# EasyEDA Pro project ProPrj_FOC Motor Driver _V02.epro, board V01
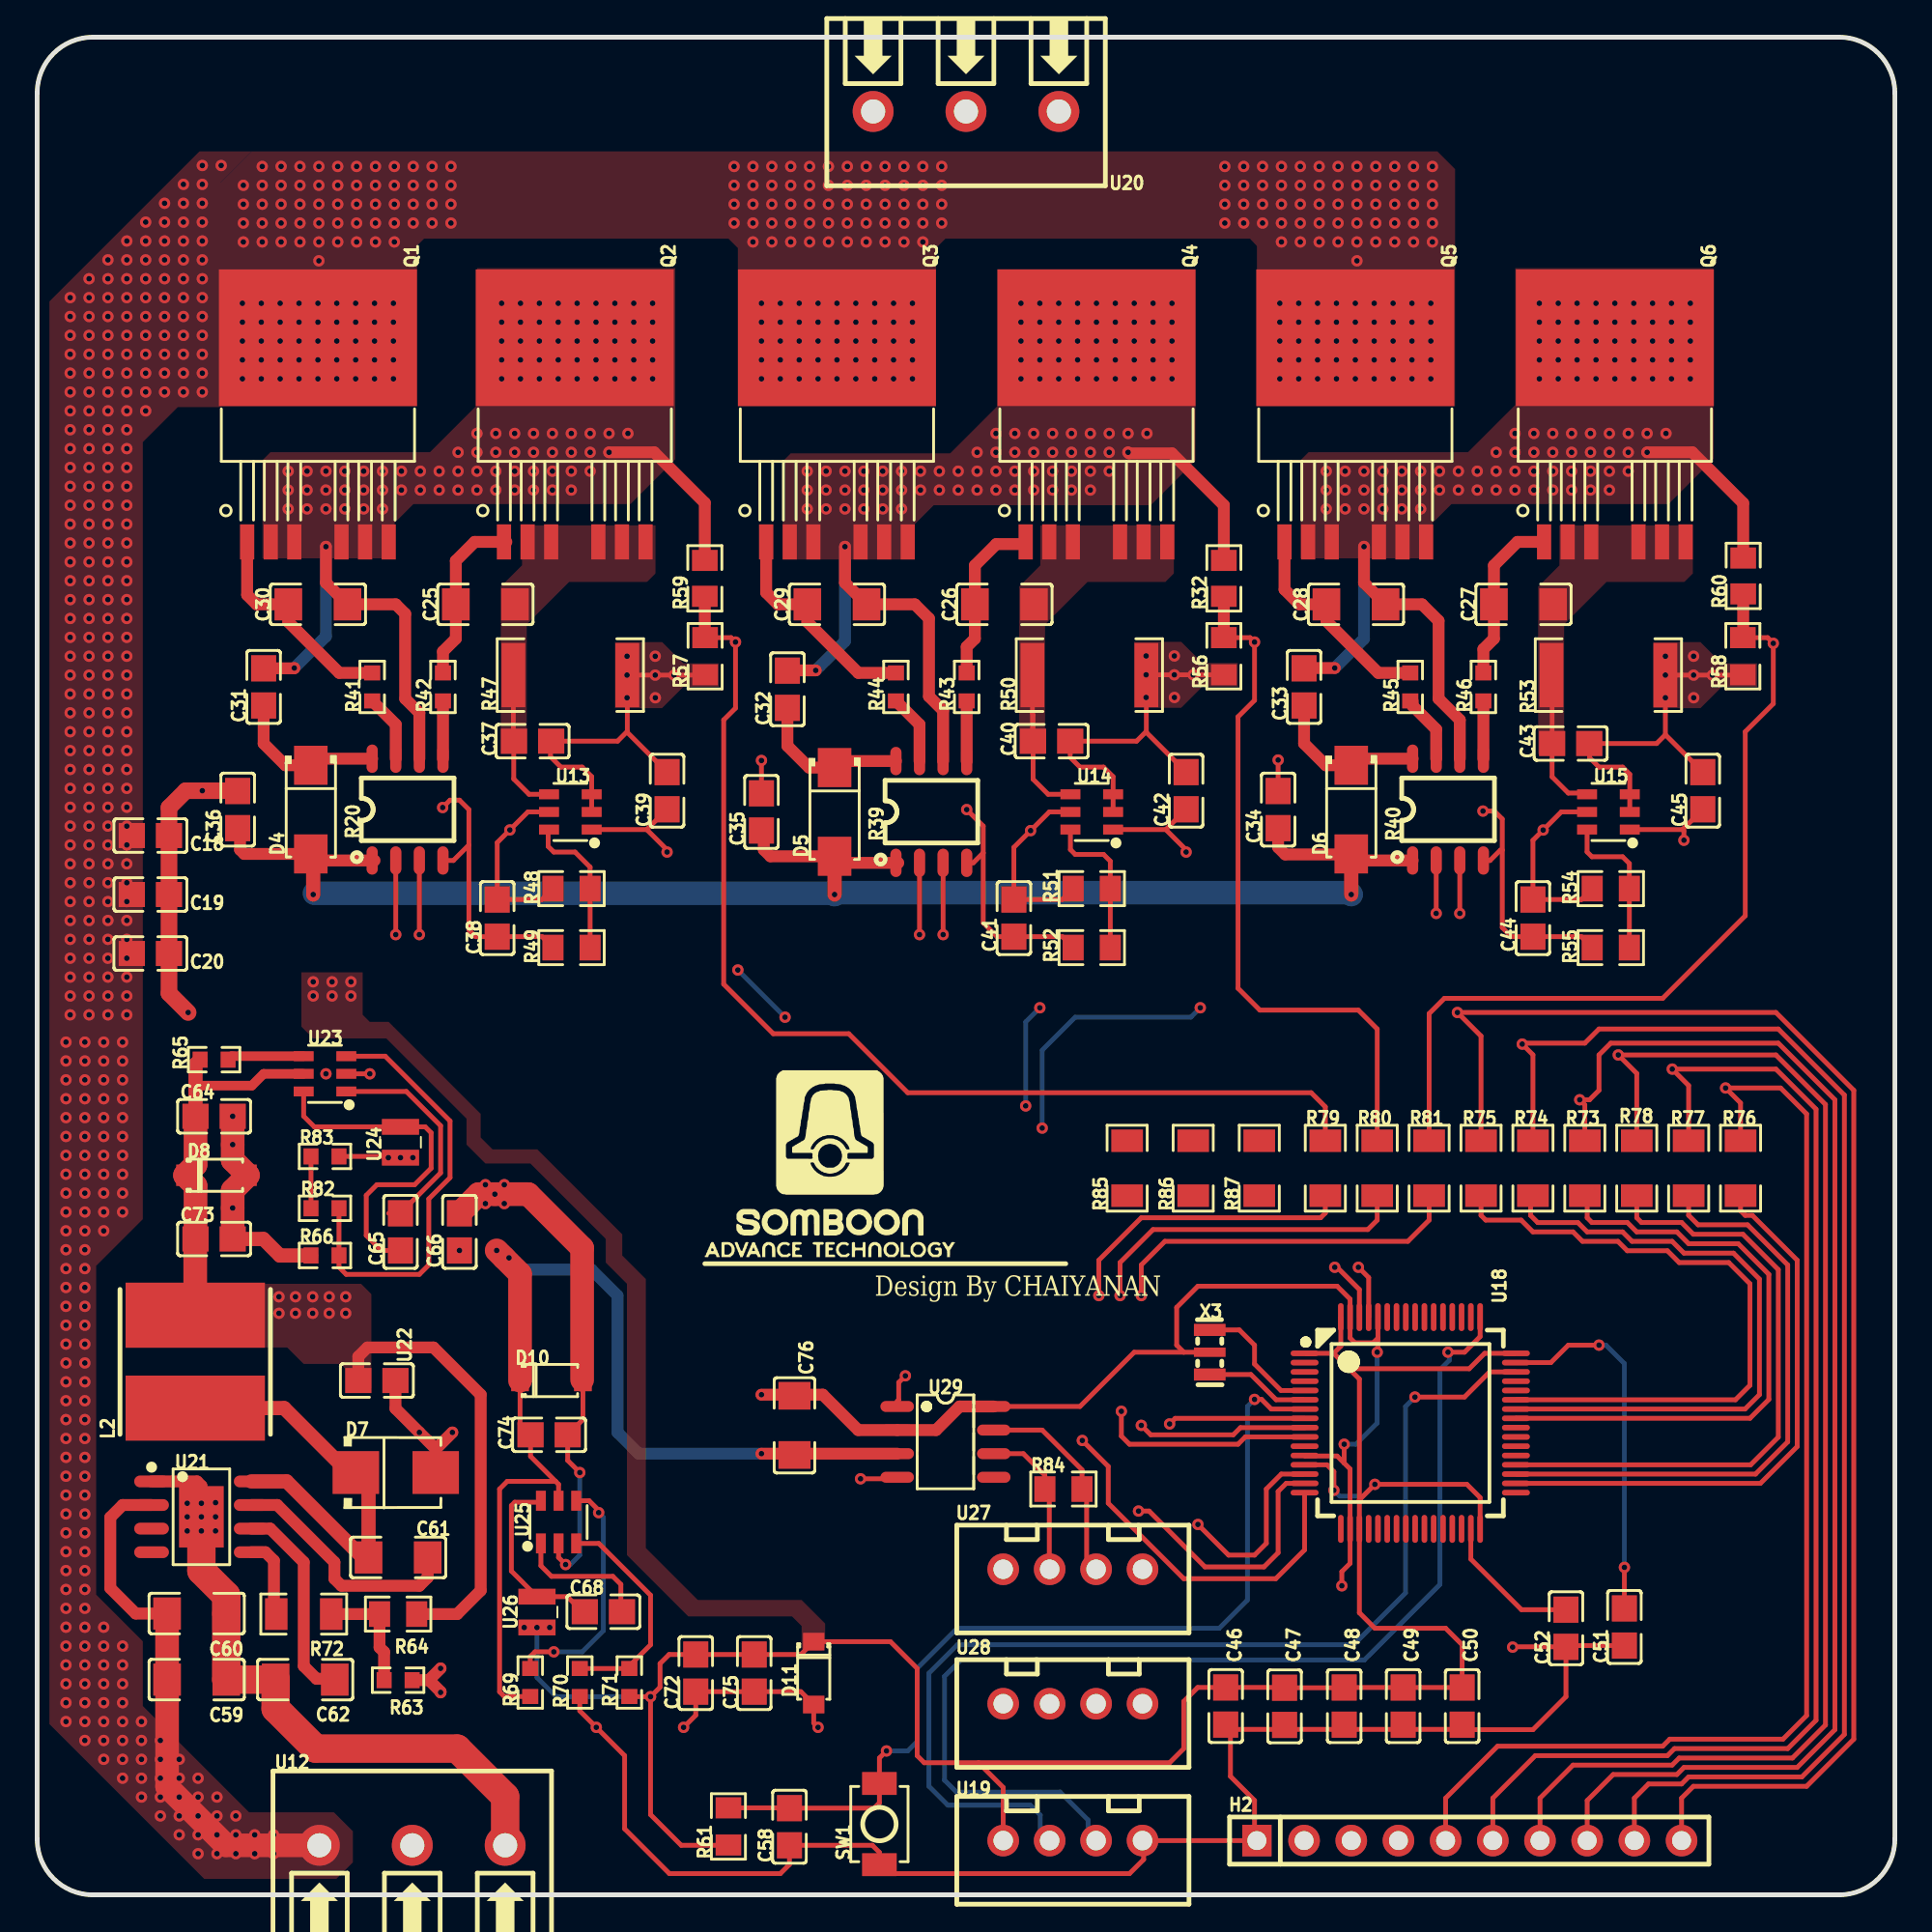
[diagram p12: board, top side]
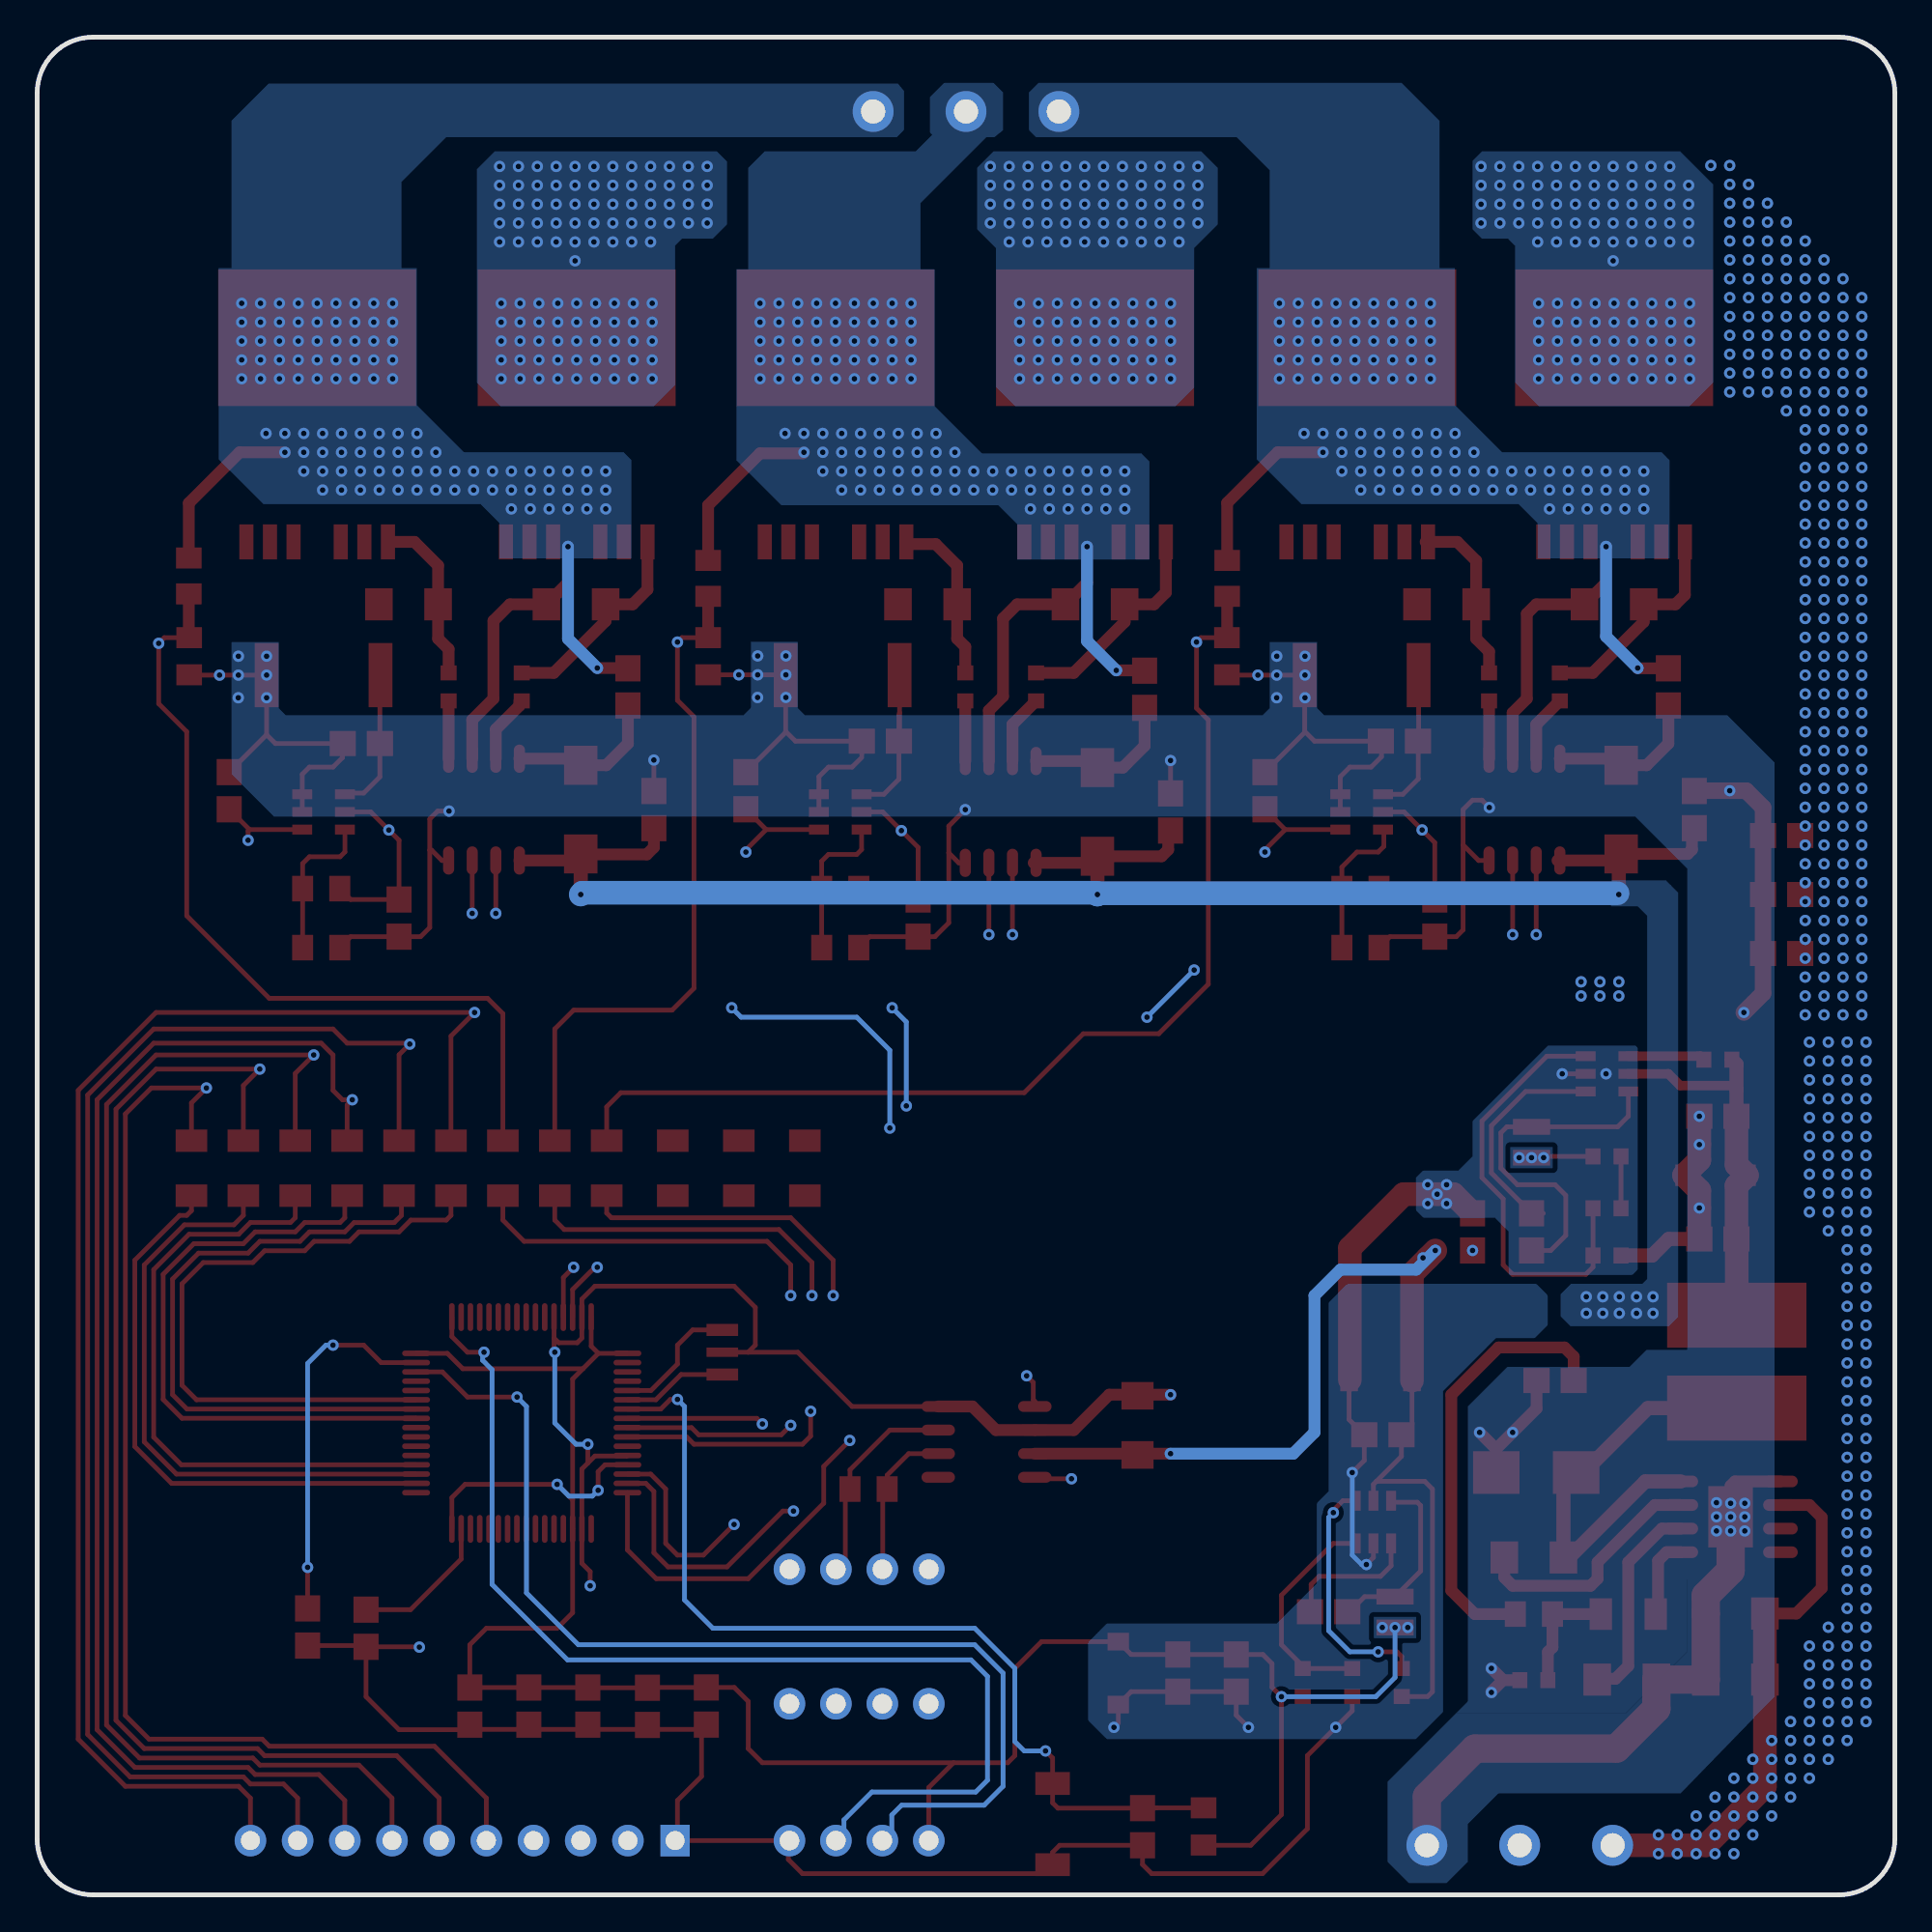
[diagram p13: board, bottom side, seen from below]

Outline 100 x 100 mm; copper layers: Top Layer, Inner1, Inner2, Bottom Layer. Coordinates in mm from the lower left corner of the outline.
Outline path: 0,97 0,3 arc(0.88,0.88) 3,0 97,0 arc(99.12,0.88) 100,3 100,97 arc(99.12,99.12) 97,100 3,100 arc(0.88,99.12) 0,97
Stack: Top Layer 0.035mm Outer layer thickness 1oz / Dielectric1 0.2104mm 7628 RC49% 8.6mil / Inner1 0.0152mm Inner layer thickness / Dielectric2 1.065mm 1.1mm H/HOZ Copper / Inner2 0.0152mm Inner layer thickness / Dielectric3 0.2104mm 7628 RC49% 8.6mil / Bottom Layer 0.035mm Outer layer thickness 1oz

## Design rules (mm)
template: JLCPCB Capability(Two Layers Board)
spacing copperThickness1oz (default): track to track 0.102, other pairs 0.152 to 0.3
spacing copperThickness2oz: track to track 0.203, other pairs 0.152 to 0.3
track width copperThickness1oz (default): min 0.127, default 0.254, max 2.54
track width copperThickness2oz: min 0.203, default 0.254, max 2.54
differential pair differentialPair (default): width min 0.127, default 0.254, max 2.54; gap min 0.152, default 0.152
via viaSize (default): diameter min 0.5, default 0.61, max 10; hole min 0.3, default 0.305, max 6.3

## Placement (name value [footprint] x y rotation side)
C18  2.2uF  [C0805]  6.1 57.02 180 top
C19  2.2uF  [C0805]  6.1 53.85 180 top
C20  2.2uF  [C0805]  6.1 50.67 180 top
C25  22nF  [C1206]  24.13 69.47 0 top
C26  22nF  [C1206]  52.07 69.47 0 top
C27  22nF  [C1206]  80.01 69.47 0 top
C28  22nF  [C1206]  70.99 69.47 0 top
C29  22nF  [C1206]  43.05 69.47 0 top
C30  22nF  [C1206]  15.11 69.47 0 top
C31  10uF  [C0805]  12.19 65.02 270 top
C32  10uF  [C0805]  40.39 64.9 270 top
C33  10uF  [C0805]  68.2 65.02 270 top
C34  10uF  [C0805]  66.8 58.42 270 top
C35  10uF  [C0805]  38.99 58.29 270 top
C36  10uF  [C0805]  10.8 58.42 270 top
C37  100nF  [C0805]  26.67 62.1 180 top
C38  100nF  [C0805]  24.77 52.58 90 top
C39  100nF  [C0805]  33.91 59.44 90 top
C40  100nF  [C0805]  54.61 62.1 180 top
C41  100nF  [C0805]  52.58 52.58 90 top
C42  100nF  [C0805]  61.85 59.44 90 top
C43  100nF  [C0805]  82.55 61.98 180 top
C44  100nF  [C0805]  80.52 52.58 90 top
C45  100nF  [C0805]  89.66 59.44 90 top
C46  1uF  [C0805]  63.98 10.16 90 top
C47  1uF  [C0805]  67.15 10.15 90 top
C48  1uF  [C0805]  70.36 10.16 90 top
C49  2.2uF  [C0805]  73.53 10.16 90 top
C50  1uF  [C0805]  76.71 10.16 90 top
C51  2.2uF  [C0805]  85.44 14.42 90 top
C52  2.2uF  [C0805]  82.3 14.35 90 top
C58  100nF  [C0805]  40.5 3.67 270 top
C59  100nF  [C1206]  8.59 11.59 180 top
C60  2.2uF  [C1206]  8.59 15.14 180 top
C61  100nF  [C1206]  19.43 18.16 180 top
C62  2.2uF  [C1206]  14.43 11.59 180 top
C64  4.7uF  [C0805]  9.53 41.91 180 top
C65  22nF  [C0805]  19.56 35.69 270 top
C66  4.7uF  [C0805]  22.73 35.69 270 top
C68  22nF  [C0805]  30.48 15.24 180 top
C72  1uF  [C0805]  35.45 11.94 90 top
C73  22uF  [C0805]  9.53 35.31 180 top
C74  22uF  [C0805]  27.56 24.76 180 top
C75  22uF  [C0805]  38.6 11.94 90 top
C76  2.2uF  [C1206]  40.77 25.27 270 top
D4  FR107  [SMA_L4.2-W2.7-LS5.3-FD]  14.73 58.42 90 top
D5  FR107  [SMA_L4.2-W2.7-LS5.3-FD]  42.93 58.29 90 top
D6  FR107  [SMA_L4.2-W2.7-LS5.3-FD]  70.74 58.42 90 top
D7  SS510B  [SMB_L4.3-W3.6-LS5.3-RD]  19.3 22.73 0 top
D8  SMF12A  [SOD-123_L2.8-W1.8-LS3.7-RD]  9.65 38.73 0 top
D10  SMF5.0A  [SOD-123_L2.8-W1.8-LS3.7-RD]  27.69 27.69 0 top
D11  SMF3.3A  [SOD-123_L2.8-W1.8-LS3.7-RD]  41.8 11.94 270 top
H2  XY-PZ2.54V-01-10P  [HDR-TH_10P-P2.54-V-M_4]  77.09 2.92 0 top
L2  68uH  [IND-SMD_L7.8-W7.0_SCD0705N]  8.51 28.7 90 top
Q1  IRFS7530TRL7PP  [D2PAK-7_L10.6-W9.6-P1.27-LS15.9-BR]  15.11 78.32 270 top
Q2  IRFS7530TRL7PP  [D2PAK-7_L10.6-W9.6-P1.27-LS15.9-BR]  28.94 78.32 270 top
Q3  IRFS7530TRL7PP  [D2PAK-7_L10.6-W9.6-P1.27-LS15.9-BR]  43.05 78.32 270 top
Q4  IRFS7530TRL7PP  [D2PAK-7_L10.6-W9.6-P1.27-LS15.9-BR]  57.02 78.32 270 top
Q5  IRFS7530TRL7PP  [D2PAK-7_L10.6-W9.6-P1.27-LS15.9-BR]  70.96 78.32 270 top
Q6  IRFS7530TRL7PP  [D2PAK-7_L10.6-W9.6-P1.27-LS15.9-BR]  84.93 78.32 270 top
R20  EG3112D  [SOP-8_L5.0-W3.9-P1.27-LS6.0-BL-1]  19.94 58.42 0 top
R32  56K  [R0805_NEW]  63.88 70.87 90 top
R39  EG3112D  [SOP-8_L5.0-W3.9-P1.27-LS6.0-BL-1]  48.13 58.29 0 top
R40  EG3112D  [SOP-8_L5.0-W3.9-P1.27-LS6.0-BL-1]  75.95 58.42 0 top
R41  10Ω  [R0603]  18.03 65.02 90 top
R42  10Ω  [R0603]  21.84 65.02 90 top
R43  10Ω  [R0603]  50.04 65.02 90 top
R44  10Ω  [R0603]  46.23 65.02 90 top
R45  10Ω  [R0603]  73.91 65.02 90 top
R46  10Ω  [R0603]  77.85 65.02 90 top
R47  1mΩ  [R2512]  28.7 65.66 180 top
R48  1kΩ  [R0805]  28.77 54.17 0 top
R49  1kΩ  [R0805]  28.77 50.99 0 top
R50  1mΩ  [R2512]  56.64 65.66 180 top
R51  1kΩ  [R0805]  56.77 54.17 0 top
R52  1kΩ  [R0805]  56.77 50.99 0 top
R53  1mΩ  [R2512]  84.58 65.66 180 top
R54  1kΩ  [R0805]  84.71 54.17 0 top
R55  1kΩ  [R0805]  84.71 50.99 0 top
R56  2.2kΩ  [R0805]  63.88 66.67 90 top
R57  2.2kΩ  [R0805]  35.96 66.67 90 top
R58  2.2kΩ  [R0805]  91.82 66.67 90 top
R59  56K  [R0805_NEW]  35.94 70.87 90 top
R60  56K  [R0805_NEW]  91.84 71 90 top
R61  10kΩ  [R0805]  37.21 3.68 90 top
R63  30kΩ  [R0603]  19.43 11.56 180 top
R64  274kΩ  [R0805]  19.43 15.11 0 top
R65  10kΩ  [R0603]  9.53 44.96 0 top
R66  10kΩ  [R0603]  15.49 34.42 0 top
R69  10kΩ  [R0603]  26.54 11.43 90 top
R70  10kΩ  [R0603]  29.21 11.43 90 top
R71  45.3kΩ  [R0603]  31.88 11.43 270 top
R72  5.1kΩ  [R1206]  14.35 15.11 0 top
R73  0Ω  [R1206]  83.31 39.12 270 top
R74  0Ω  [R1206]  80.52 39.12 270 top
R75  0Ω  [R1206]  77.72 39.12 270 top
R76  0Ω  [R1206]  91.69 39.12 270 top
R77  0Ω  [R1206]  88.9 39.12 270 top
R78  0Ω  [R1206]  86.11 39.12 270 top
R79  0Ω  [R1206]  69.34 39.12 270 top
R80  0Ω  [R1206]  72.14 39.12 270 top
R81  0Ω  [R1206]  74.93 39.12 270 top
R82  4.3kΩ  [R0603]  15.49 36.96 180 top
R83  73.2kΩ  [R0603]  15.49 39.75 0 top
R84  120Ω  [R0805]  55.25 21.84 0 top
R85  0Ω  [R1206]  58.67 39.12 90 top
R86  0Ω  [R1206]  62.23 39.12 90 top
R87  0Ω  [R1206]  65.79 39.12 90 top
SW1  TS-1088-AR02016  [SW-SMD_L3.9-W3.0-P4.45]  45.34 3.81 90 top
U12  1935174  [CONN-TH_3P-P5.00_1935174]  20.19 2.67 0 top
U13  INA181A1IDBVR  [SOT-23-6_L2.9-W1.6-P0.95-LS2.8-TL]  28.7 58.29 180 top
U14  INA181A1IDBVR  [SOT-23-6_L2.9-W1.6-P0.95-LS2.8-TL]  56.77 58.29 180 top
U15  INA181A1IDBVR  [SOT-23-6_L2.9-W1.6-P0.95-LS2.8-TL]  84.58 58.29 180 top
U18  STM32F405RGT6  [LQFP-64_L10.0-W10.0-P0.50-LS12.0-BL]  73.91 25.4 270 top
U19  xh2.54-4p(直针)  [CONN-TH_4P-P2.50-XH2.54-4P]  55.75 2.92 0 top
U20  1935174  [CONN-TH_3P-P5.00_1935174]  50 96 180 top
U21  SCT2A23STER  [ESOP-8_L4.9-W3.9-P1.27-LS6.0-BL-EP-1]  8.84 20.35 270 top
U22  68pF  [C0805]  18.29 27.69 180 top
U23  RY8120  [SOT-23-6_L2.9-W1.6-P0.95-LS2.8-BL]  15.49 44.2 90 top
U24  2.2uH  [IND-SMD_L2.5-W2.0-VLS252012CX-150M]  19.56 40.51 270 top
U25  RY8120  [SOT-23-6_L2.9-W1.6-P0.95-LS2.8-BL]  28.07 20.07 0 top
U26  2.2uH  [IND-SMD_L2.5-W2.0-VLS252012CX-150M]  26.91 15.22 270 top
U27  xh2.54-4p(直针)  [CONN-TH_4P-P2.50-XH2.54-4P]  55.75 17.53 0 top
U28  xh2.54-4p(直针)  [CONN-TH_4P-P2.50-XH2.54-4P]  55.75 10.29 0 top
U29  MCP2551-I/SN  [SOIC-8_L4.9-W3.9-P1.27-LS6.0-BL]  48.9 24.38 270 top
X3  8MHz  [OSC-SMD_3P-L3.2-W1.3-P1.2-L]  63.12 29.21 270 top

## Footprints (pads in the part's own frame, mm; a bottom-side part is the same pattern mirrored in y, then rotated)
C0805
  rect 1.41x1.35 smd: 1(-1,0) 2(1,0)
C1206
  rect 1.485x1.728 smd: 1(-1.593,0) 2(1.593,0)
CONN-TH_3P-P5.00_1935174
  round 2.2 hole 1.3: 1(-5,0) 2(0,0) 3(5,0)
CONN-TH_4P-P2.50-XH2.54-4P
  round 1.7 hole 1.05: 1(3.75,0) 2(1.25,0) 3(-1.25,0) 4(-3.75,0)
D2PAK-7_L10.6-W9.6-P1.27-LS15.9-BR
  rect 1.887x0.762 smd: 1(5.495,-3.81) 2(5.495,-2.54) 3(5.495,-1.27) 5(5.495,1.27) 6(5.495,2.54) 7(5.495,3.81)
  rect 7.356x10.66 smd: 4(-5.495,0)
ESOP-8_L4.9-W3.9-P1.27-LS6.0-BL-EP-1
  oval 0.63x1.865 smd: 1(-1.905,-2.683) 2(-0.635,-2.683) 3(0.635,-2.683) 4(1.905,-2.683) 5(1.905,2.683) 6(0.635,2.683) 7(-0.635,2.683) 8(-1.905,2.683)
  rect 3.3x2.4 smd: 9(0,0)
HDR-TH_10P-P2.54-V-M_4
  rect 1.575x1.7 hole 1.02: 1(-11.43,0)
  round 1.7 hole 1.02: 2(-8.89,0) 3(-6.35,0) 4(-3.81,0) 5(-1.27,0) 6(1.27,0) 7(3.81,0) 8(6.35,0) 9(8.89,0) 10(11.43,0)
IND-SMD_L2.5-W2.0-VLS252012CX-150M
  rect 0.85x2 smd: 1(-0.83,0) 2(0.83,0)
IND-SMD_L7.8-W7.0_SCD0705N
  rect 3.5x7.5 smd: 1(-2.5,0) 2(2.5,0)
LQFP-64_L10.0-W10.0-P0.50-LS12.0-BL
  oval 0.3x1.5 smd: 1(-3.75,-5.688) 2(-3.25,-5.688) 3(-2.75,-5.688) 4(-2.25,-5.688) 5(-1.75,-5.688) 6(-1.25,-5.688) 7(-0.75,-5.688) 8(-0.25,-5.688) 9(0.25,-5.688) 10(0.75,-5.688) 11(1.25,-5.688) 12(1.75,-5.688) 13(2.25,-5.688) 14(2.75,-5.688) 15(3.25,-5.688) 16(3.75,-5.688) 33(3.75,5.688) 34(3.25,5.688) 35(2.75,5.688) 36(2.25,5.688) 37(1.75,5.688) 38(1.25,5.688) 39(0.75,5.688) 40(0.25,5.688) 41(-0.25,5.688) 42(-0.75,5.688) 43(-1.25,5.688) 44(-1.75,5.688) 45(-2.25,5.688) 46(-2.75,5.688) 47(-3.25,5.688) 48(-3.75,5.688)
  oval 1.5x0.3 smd: 17(5.7,-3.738) 18(5.7,-3.238) 19(5.7,-2.738) 20(5.7,-2.238) 21(5.7,-1.738) 22(5.7,-1.238) 23(5.7,-0.739) 24(5.7,-0.238) 25(5.7,0.262) 26(5.7,0.762) 27(5.7,1.262) 28(5.7,1.762) 29(5.7,2.261) 30(5.7,2.762) 31(5.7,3.261) 32(5.7,3.762) 49(-5.7,3.762) 50(-5.7,3.261) 51(-5.7,2.762) 52(-5.7,2.261) 53(-5.7,1.762) 54(-5.7,1.262) 55(-5.7,0.762) 56(-5.7,0.262) 57(-5.7,-0.238) 58(-5.7,-0.739) 59(-5.7,-1.238) 60(-5.7,-1.738) 61(-5.7,-2.238) 62(-5.7,-2.738) 63(-5.7,-3.238) 64(-5.7,-3.738)
OSC-SMD_3P-L3.2-W1.3-P1.2-L
  rect 0.65x1.7 smd: 1(-1.2,0) 3(1.2,0)
  rect 0.5x1.7 smd: 2(0,0)
R0603
  rect 0.806x0.864 smd: 1(-0.753,0) 2(0.753,0)
R0805
  rect 1.133x1.377 smd: 1(-1,0) 2(1,0)
R0805_NEW
  rect 1.133x1.377 smd: 1(-0.966,0) 2(0.966,0)
R1206
  rect 1.208x1.701 smd: 1(-1.479,0) 2(1.479,0)
R2512
  rect 1.282x3.456 smd: 1(-3.067,0) 2(3.067,0)
SMA_L4.2-W2.7-LS5.3-FD
  rect 2.1x1.8 smd: 1(-2.386,0) 2(2.386,0)
SMB_L4.3-W3.6-LS5.3-RD
  rect 2.5x2.3 smd: 1(-2.15,0) 2(2.15,0)
SOD-123_L2.8-W1.8-LS3.7-RD
  rect 0.95x1.15 smd: 1(-1.692,0) 2(1.692,0)
SOIC-8_L4.9-W3.9-P1.27-LS6.0-BL
  oval 0.588x1.8 smd: 1(-1.905,-2.6) 2(-0.635,-2.6) 3(0.635,-2.6) 4(1.905,-2.6) 5(1.905,2.6) 6(0.635,2.6) 7(-0.635,2.6) 8(-1.905,2.6)
SOP-8_L5.0-W3.9-P1.27-LS6.0-BL-1
  oval 0.6x1.52 smd: 1(-1.905,-2.74) 2(-0.635,-2.74) 3(0.635,-2.74) 4(1.905,-2.74) 5(1.905,2.74) 6(0.635,2.74) 7(-0.635,2.74) 8(-1.905,2.74)
SOT-23-6_L2.9-W1.6-P0.95-LS2.8-BL
  rect 0.532x1.072 smd: 1(-0.95,-1.149) 2(0,-1.149) 3(0.95,-1.149) 4(0.95,1.149) 5(0,1.149) 6(-0.95,1.149)
SOT-23-6_L2.9-W1.6-P0.95-LS2.8-TL
  rect 1.072x0.532 smd: 1(-1.149,0.95) 2(-1.149,0) 3(-1.149,-0.95) 4(1.149,-0.95) 5(1.149,0) 6(1.149,0.95)
SW-SMD_L3.9-W3.0-P4.45
  rect 1.23x1.86 smd: 1(-2.185,0) 2(2.185,0)

## Nets
As in the schematic.

Pads without a net: R85 2; R86 2; R87 2; U12 2; U18 2 3 4 11 17 20 21 22 23 24 25 26 27 28 29 30 33 37 38 39 40 50 51 52 53 54 55 56 57 58 59; U21 3 4; U27 1 4; U28 1 2 3 4; U29 5

## Via types
v1: diameter 0.61, hole 0.305, Top Layer to Bottom Layer, 1114 vias

## Routing (per net, layer and track width the routed paths; a pad name or vN(x,y) marks a point on that pad's centre or on a via; arc(x,y) is an arc through that point)
3.3V: length 231.8
  Top Layer w0.254: 70.62,28.32 77.09,28.32 77.92,29.15 U18.48 ; 70.62,28.32 69.79,29.15 ; 70.62,28.32 71.18,27.76 71.18,21.26 ; 71.18,21.26 U18.19 71.18,15.18 72.01,14.35 75.82,14.35 76.71,13.46 C50.2 C49.2 C48.2 70.35,11.15 C47.2 67.13,11.16 C46.2 62.47,11.16 61.72,10.41 61.72,7.87 60.96,7.11 50.67,7.11 ; 71.18,21.26 v1(72.01,22.1) 76.96,22.1 77.68,21.38 U18.32 ; 50.67,7.11 52,5.78 U19.4 ; 50.67,7.11 47.75,7.11 47.37,7.49 47.37,12.19 45.93,13.63 D11.1 41.11,12.94 C75.2 C72.2 34.02,12.94 33.53,12.45 33.53,11.18 v1(33.02,10.67) ; R71.2 31.89,10.67 v1(33.02,10.67) ; 69.79,29.15 70.18,29.54 U18.64 ; 69.79,29.15 U18.1 ; v1(33.02,10.67) 33.02,4.32 34.67,2.67 37.19,2.67 R61.1 ; R48.1 27.18,53.58 C38.2 24.77,56.64 v1(25.45,57.32) 26.42,58.29 U13.5 ; v1(69.8,21.78) 69.8,22.78 69.43,23.15 U18.13 ; U15.5 82.04,58.29 v1(81.07,57.32) 80.52,56.77 C44.2 83.12,53.58 R54.1 ; R51.1 55.18,53.58 C41.2 52.58,56.39 v1(53.48,57.29) 54.48,58.29 U14.5
  Inner2 w0.508: v1(81.07,57.32) 81.04,57.29 v1(53.48,57.29) 53.44,57.32 v1(25.45,57.32)
  Inner2 w0.889: v1(25.45,57.32) 19.99,57.32 15.88,53.21 15.88,49.29
  Bottom Layer w0.254: v1(33.02,10.67) 27.94,10.67 26.91,11.7 v1(26.91,14.39) ; v1(69.8,21.78) 70.12,21.46 71.37,21.46 v1(72.01,22.1)
  vias: v1(14.86,49.15) v1(14.86,48.39) v1(15.88,49.15) v1(15.88,48.39) v1(16.89,49.15) v1(16.89,48.39) v1(26.22,14.39) v1(27.59,14.39)
12V: length 132.2
  Top Layer w0.508: 8.53,43.35 8.74,43.56 11.56,43.56 12.19,44.2 U23.5
  Top Layer w0.635: R64.2 22.61,15.11 23.88,16.38 23.88,26.92 21.34,29.46 17.78,29.46 17.29,28.97 U22.2 ; R40.1 71.09,55.68 D6.1 70.71,56.01 67.18,56.01 66.8,56.39 C34.2 ; 46.35,55.55 43.41,55.55 43.05,55.91 D5.1 39.47,55.91 39.12,56.26 39.12,57.29 ; 10.92,57.42 10.92,56.26 11.15,56.03 D4.1 14.86,56.03 15.21,55.68 18.16,55.68
  Top Layer w0.762: C64.2 8.53,44.71 R65.1 ; D5.1 v1(42.93,53.85) ; 14.86,55.91 v1(14.86,53.85) ; D6.1 v1(70.74,53.85)
  Top Layer w1.27: L2.2 8.51,35.29 C73.2 8.53,38.17 D8.1 8.53,39.3 C64.2
  Bottom Layer w1.27: 14.93,53.92 42.86,53.92 v1(42.93,53.85) 43.02,53.95 70.64,53.95 v1(70.74,53.85)
  vias: v1(13.02,32.19) v1(13.02,31.31) v1(13.91,32.19) v1(13.91,31.31) v1(14.83,32.19) v1(14.83,31.31) v1(15.72,32.19) v1(15.72,31.31) v1(16.61,32.19) v1(16.61,31.31)
+5V: length 73.2
  Top Layer w0.254: 27.91,22.26 28.07,22.1 U25.5 ; 27.91,22.26 25.31,22.26 24.89,21.84 24.89,10.93 25.15,10.68 R69.1 ; 27.91,22.26 26.56,23.61 C74.2 25.99,25.33 D10.1 ; v1(25.4,34.29) 25.13,34.29 ; v1(19.56,39.68) 19.49,39.75 R83.2
  Top Layer w0.635: U29.3 v1(38.99,23.75)
  Top Layer w1.27: v1(24.74,34.69) 25.99,33.43 D10.1
  Inner2 w1.524: v1(24.74,34.69) v1(22.73,34.69) 22.34,34.69 19.56,37.47 19.56,39.62
  Bottom Layer w0.635: v1(38.99,23.75) 32.38,23.75 31.24,24.89 31.24,32.26 29.84,33.66 25.77,33.66 v1(24.74,34.69)
  vias: v1(18.91,39.68) v1(20.22,39.68)
AGND: length 390.3
  Top Layer w0.254: C45.2 87.65,62.45 ; 87.65,62.45 v1(87.65,64.44) 87.65,65.53 ; 87.65,62.45 87.17,61.98 83.57,61.98 ; v1(29.21,22.73) 28.56,23.38 C74.1 29.38,25.58 D10.2 ; C50.1 76.98,8.89 80.52,8.89 82.3,10.67 C52.1 ; v1(34.8,9.02) 35.45,9.67 C72.1 C75.1 41.11,10.94 D11.2 41.8,9.25 v1(42.04,9.02) ; 78.87,56.23 78.77,56.23 78.21,55.68 R40.4 ; 78.87,56.23 78.87,52.07 79.36,51.58 C44.1 83.12,51.58 R55.1 ; 78.87,56.23 78.87,57.91 78.44,58.34 v1(77.83,58.34) ; 83.57,61.98 C43.1 83.57,61.96 ; 83.57,61.98 83.57,61.96 ; v1(17.91,44.2) U23.2 ; 23.24,56.52 23.24,51.94 23.61,51.58 C38.1 27.18,51.58 R49.1 ; 23.24,56.52 22.41,55.68 R20.4 ; 23.24,56.52 23.24,58.42 22.73,58.93 22.22,58.93 v1(21.83,58.53) ; 31.77,62.63 R47.1 35.91,65.66 35.96,65.71 ; 31.77,62.63 31.24,62.1 C37.1 ; 31.77,62.63 31.77,62.58 C39.2 ; U14.2 U14.3 57.92,60.19 57.4,60.71 56.13,60.71 55.61,61.23 ; 59.71,62.63 59.71,62.58 C42.2 ; 59.71,62.63 R50.1 59.72,65.67 ; 59.71,62.63 59.18,62.1 C40.1 55.61,61.36 ; v1(72.14,29.21) 72.18,29.25 72.18,29.97 ; 59.98,65.67 R56.1 ; C52.1 82.36,13.42 C51.1 ; C52.1 79.44,13.35 v1(79.43,13.34) ; 76.71,8.91 64.24,8.91 ; 64.24,8.91 C46.1 ; 64.24,8.91 64.24,6.38 65.53,5.08 65.53,3.05 H2.1 59.56,2.92 59.56,1.91 58.8,1.14 45.82,1.14 SW1.1 45.34,2.29 44.96,2.67 C58.2 40.5,1.63 40,1.14 34.04,1.14 31.62,3.56 31.62,7.49 v1(30.1,9.02) 29.21,9.91 R70.1 ; U25.2 28.07,18.16 v1(28.45,17.78) ; 25.15,37.08 25.02,37.21 ; U18.12 68.25,23.62 69.98,23.62 70.36,23.24 ; 83.57,61.96 83.57,61.21 84.07,60.71 85.34,60.71 85.73,60.32 U15.3 U15.2 ; 61.72,29.21 59.06,29.21 56.13,26.29 U29.8 ; 61.72,29.21 61.34,29.59 61.34,31.62 62.48,32.77 69.98,32.77 70.68,32.07 U18.63 70.68,29.97 70.93,29.72 71.92,29.72 72.18,29.97 ; 61.72,29.21 X3.2 ; v1(87.65,65.66) 91.66,65.66 91.82,65.82 ; 72.18,29.97 U18.60 ; 70.36,23.24 70.68,22.92 U18.18 70.68,17.84 70.23,17.4 v1(70.23,16.64) ; 70.36,23.24 v1(70.36,24.26) ; v1(50.04,58.42) 50.93,57.53 50.93,56.09 ; 50.04,55.55 50.39,55.55 50.93,56.09 ; R52.1 55.18,51.58 C41.1 51.67,51.58 50.93,52.32 50.93,56.09 ; U13.2 U13.3 29.85,60.19 29.34,60.71 28.19,60.71 27.63,61.27 27.63,62.07 ; v1(66.8,61.09) C34.1 ; 21.45,23.99 D7.2 ; C35.1 v1(38.99,61.06)
  Top Layer w0.635: v1(22.35,24.89) 21.45,23.99 ; R63.1 21.08,11.56 ; 21.08,11.56 v1(21.72,12.19) ; 21.08,11.56 21.1,11.56 21.72,10.94 v1(21.72,10.9) ; U22.1 19.29,26.18 v1(20.57,24.89) 21.45,24.01 ; U29.8 49.66,26.29 48.39,25.02 44.2,25.02 42.29,26.92 40.83,26.92 C76.1 40.71,26.92 v1(38.99,26.92) ; v1(8.84,20.35) 8.84,22.02 8.61,22.25 U21.1
  Top Layer w0.762: R66.1 13.06,34.42 12.18,35.31 C73.1
  Top Layer w0.889: v1(8.13,47.5) 7.1,48.53 C20.1 C19.1 C18.1 7.1,58.53 8,59.44 v1(8.89,59.44) 10.78,59.44 C36.1
  Top Layer w1.27: v1(10.53,41.91) v1(10.53,40.39) 10.53,39.55 D8.2 10.53,37.92 v1(10.53,36.97) C73.1 ; 29.34,27.73 29.34,34.82 26.43,37.72 v1(24.64,37.72) 23.77,37.72 C66.1
  Top Layer w1.524: v1(8.84,20.35) v1(8.84,19.59) 8.84,17.45 10.18,16.11 C60.1 C59.1 C62.2 12.84,10.02 14.99,7.87 22.61,7.87 25.19,5.29 U12.3
  Inner1 w0.635: v1(29.21,22.73) 35.81,22.73 37.08,24 37.08,25.91 38.1,26.92 v1(38.99,26.92)
  Inner2 w0.254: v1(70.23,16.64) 70.23,16.13 72.01,14.35 75.82,14.35 76.84,13.34 v1(79.43,13.34)
  Inner2 w1.524: v1(17.91,44.2) v1(15.55,44.2) 12.81,44.2 v1(10.53,41.91)
  Bottom Layer w0.254: v1(29.21,22.73) 29.21,18.29 28.7,17.78 v1(28.45,17.78) ; v1(70.36,24.26) 70.99,24.26 72.14,25.4 v1(72.14,29.21)
  vias: v1(8.08,21.08) v1(8.08,20.35) v1(8.08,19.59) v1(8.84,21.08) v1(9.6,21.11) v1(9.6,20.35) v1(9.6,19.59) v1(24.13,38.23) v1(24.13,37.21) v1(25.15,38.23) v1(25.15,37.21) v1(31.75,66.67) v1(31.75,65.66) v1(31.75,64.44) v1(33.27,66.67) v1(33.27,65.66) v1(33.28,64.44) v1(34.29,65.66) v1(59.7,66.69) v1(59.7,65.67) v1(59.7,64.46) v1(61.21,66.69) v1(61.21,65.67) v1(61.22,64.46) v1(62.23,65.67) v1(87.65,66.67) v1(89.17,66.67) v1(89.17,65.66) v1(89.17,64.44) v1(90.18,65.66)
CLK: length 59.9
  Top Layer w0.254: U18.49 77.68,30.05 76.84,29.21 v1(75.95,29.21)
  Bottom Layer w0.254: v1(75.95,29.21) 76.02,29.14 76.02,28.78 75.51,28.27 75.51,16.71 71.45,12.65 49.73,12.65 48.84,11.76 48.84,6.17 49.48,5.54 55.07,5.54 56.57,4.03 56.57,3 56.5,2.92
CUR1: length 7.9
  Top Layer w0.254: 25.64,62.12 25.64,62.14 ; 25.64,62.14 R47.2 ; 25.64,62.14 25.65,62.12 ; 25.65,62.09 C37.2 25.65,62.12 ; 25.65,62.09 25.65,60.07 26.48,59.24 U13.4 ; 25.65,62.09 25.65,62.12
CUR2: length 9.4
  Top Layer w0.254: 53.58,63.63 53.58,62.14 C40.2 53.61,63.5 53.58,63.63 ; 53.58,63.63 R50.2 ; U14.4 54.42,59.24 53.61,60.06 53.61,61.98
CUR3: length 7.6
  Top Layer w0.254: 81.52,65.53 81.55,65.5 C43.2 81.55,60.18 82.42,59.31 83.37,59.31 U15.4
CURRENT_U: length 96.9
  Top Layer w0.254: 32.82,57.34 33.91,56.25 v1(33.91,56.13) ; 32.82,57.34 U13.1 ; 32.82,57.34 C39.1 ; v1(60.96,25.35) 61.26,25.65 U18.8
  Inner1 w0.254: v1(33.91,56.13) 33.91,50.42 34.54,49.78 v1(37.72,49.78) ; v1(40.26,47.24) 42.8,47.24 46.86,43.18 51.05,43.18 52.32,41.91 52.32,39.12 53.85,37.59 53.85,28.19 57.78,24.26 60.58,24.26 60.83,24.51 60.83,25.22 v1(60.96,25.35)
  Inner2 w0.254: v1(60.96,25.35) 60.96,25.22 60.83,25.09 60.83,23.24 61.59,22.48 64.13,22.48 66.17,20.45 66.17,7.49 66.93,6.73 71.37,6.73 73.28,4.83 H2.4
  Bottom Layer w0.254: v1(37.72,49.78) v1(40.26,47.24)
CURRENT_V: length 87.5
  Top Layer w0.254: v1(61.85,56.13) 61.85,56.25 60.76,57.34 ; C42.1 60.76,57.34 ; 60.76,57.34 U14.1 ; U18.9 64.77,25.15 64.39,24.76 59.94,24.76 v1(59.44,25.27)
  Inner1 w0.254: v1(61.85,56.13) 61.85,48.51 61.34,48.01 54.23,48.01 v1(53.97,47.75) ; v1(53.21,42.47) 53.21,39.37 54.74,37.85 54.74,28.7 58.17,25.27 v1(59.44,25.27)
  Inner2 w0.254: H2.3 70.74,4.83 69.47,6.1 66.42,6.1 65.66,6.86 65.66,19.94 63.88,21.72 61.21,21.72 59.82,23.11 59.82,24.89 v1(59.44,25.27)
  Bottom Layer w0.254: v1(53.21,42.47) 53.21,46.99 v1(53.97,47.75)
CURRENT_W: length 111.2
  Top Layer w0.254: 88.57,57.34 88.65,57.27 v1(88.65,56.77) ; 88.57,57.34 C45.1 ; 88.57,57.34 U15.1 ; U18.10 65.04,24.65 64.64,24.26 58.8,24.26 58.36,24.69 v1(58.36,26.03)
  Inner1 w0.254: v1(62.61,47.75) 62.87,48.01 62.87,54.86 63.88,55.88 88.26,55.88 88.65,56.26 v1(88.65,56.77) ; v1(58.36,26.03) 58.36,26.09 55.37,29.08 55.37,38.23 54.1,39.5 v1(54.1,41.28)
  Inner2 w0.254: H2.2 68.2,4.83 67.56,5.46 65.91,5.46 65.15,6.22 65.15,19.43 63.63,20.96 60.58,20.96 58.36,23.17 v1(58.36,26.03)
  Bottom Layer w0.254: v1(54.1,41.28) 54.1,45.47 55.88,47.24 62.1,47.24 v1(62.61,47.75)
DIO: length 58.3
  Top Layer w0.254: U18.46 78.19,28.15 76.84,26.8 v1(74.17,26.8)
  Bottom Layer w0.254: 54,2.92 54,4.3 53.47,4.83 49.02,4.83 48.01,5.84 48.01,11.94 49.53,13.46 70.87,13.46 73.66,16.26 73.66,26.29 v1(74.17,26.8)
PHASE_U: length 33.3
  Top Layer w0.635: v1(30.78,77.65) 33.22,77.65 35.94,74.93 R59.2 ; v1(15.55,72.57) 15.55,70.63 C30.2 19.3,69.47 19.81,68.96 19.81,64.39 20.57,63.63 R20.6 ; v1(13.84,66.04) 13.83,66.02 C31.1
  Bottom Layer w0.635: v1(15.55,72.57) 15.55,67.74 v1(13.84,66.04)
  vias: v1(13.51,76.64) v1(13.51,75.62) v1(13.51,74.6) v1(14.53,76.64) v1(14.53,75.62) v1(14.53,74.6) v1(15.55,76.64) v1(15.55,75.62) v1(15.55,74.6) v1(16.56,76.64) v1(16.56,75.62) v1(16.56,74.6) v1(17.58,76.64) v1(17.58,75.62) v1(17.58,74.6) v1(18.59,76.64) v1(18.59,75.62) v1(18.59,74.6) v1(19.61,76.64) v1(19.61,75.62) v1(20.62,76.64) v1(20.62,75.62) v1(21.64,76.64) v1(21.64,75.62) v1(22.66,77.65) v1(22.66,76.64) v1(22.66,75.62) v1(23.67,78.67) v1(23.67,77.65) v1(23.67,76.64) v1(23.67,75.62) v1(24.69,78.67) v1(24.69,77.65) v1(24.69,76.64) v1(24.69,75.62) v1(25,85.67) v1(25,84.66) v1(25,83.64) v1(25,82.63) v1(25,81.61) v1(25.7,78.67) v1(25.7,77.65) v1(25.7,76.64) v1(25.7,75.62) v1(26.02,85.67) v1(26.02,84.66) v1(26.02,83.64) v1(26.02,82.63) v1(26.02,81.61) v1(26.72,78.67) v1(26.72,77.65) v1(26.72,76.64) v1(26.72,75.62) v1(27.03,85.67) v1(27.03,84.66) v1(27.03,83.64) v1(27.03,82.63) v1(27.03,81.61) v1(27.74,78.67) v1(27.74,77.65) v1(27.74,76.64) v1(27.74,75.62) v1(28.05,85.67) v1(28.05,84.66) v1(28.05,83.64) v1(28.05,82.63) v1(28.05,81.61) v1(28.75,78.67) v1(28.75,77.65) v1(28.75,76.64) v1(28.75,75.62) v1(29.07,85.67) v1(29.07,84.66) v1(29.07,83.64) v1(29.07,82.63) v1(29.07,81.61) v1(29.77,78.67) v1(29.77,77.65) v1(29.77,76.64) v1(30.08,85.67) v1(30.08,84.66) v1(30.08,83.64) v1(30.08,82.63) v1(30.08,81.61) v1(30.78,78.67) v1(31.1,85.67) v1(31.1,84.66) v1(31.1,83.64) v1(31.1,82.63) v1(31.1,81.61) v1(31.8,78.67) v1(32.11,85.67) v1(32.11,84.66) v1(32.11,83.64) v1(32.11,82.63) v1(32.11,81.61) v1(33.13,85.67) v1(33.13,84.66) v1(33.13,83.64) v1(33.13,82.63) v1(33.13,81.61)
PHASE_V: length 33.4
  Top Layer w0.635: R39.6 48.77,63.75 48.01,64.52 48.01,68.71 47.24,69.47 C29.2 43.49,70.63 v1(43.49,72.57) ; R32.2 63.88,74.8 61.09,77.6 58.78,77.6 v1(58.72,77.65) ; C32.1 40.4,65.91 v1(41.91,65.91)
  Bottom Layer w0.635: v1(41.91,65.91) 43.49,67.49 v1(43.49,72.57)
  vias: v1(41.45,76.64) v1(41.45,75.62) v1(41.45,74.6) v1(42.47,76.64) v1(42.47,75.62) v1(42.47,74.6) v1(43.49,76.64) v1(43.49,75.62) v1(43.49,74.6) v1(44.5,76.64) v1(44.5,75.62) v1(44.5,74.6) v1(45.52,76.64) v1(45.52,75.62) v1(45.52,74.6) v1(46.53,76.64) v1(46.53,75.62) v1(46.53,74.6) v1(47.55,76.64) v1(47.55,75.62) v1(48.56,76.64) v1(48.56,75.62) v1(49.58,76.64) v1(49.58,75.62) v1(50.6,77.65) v1(50.6,76.64) v1(50.6,75.62) v1(51.61,78.67) v1(51.61,77.65) v1(51.61,76.64) v1(51.61,75.62) v1(52.63,78.67) v1(52.63,77.65) v1(52.63,76.64) v1(52.63,75.62) v1(52.96,85.67) v1(52.96,84.66) v1(52.96,83.64) v1(52.96,82.63) v1(52.96,81.61) v1(53.65,78.67) v1(53.65,77.65) v1(53.65,76.64) v1(53.65,75.62) v1(53.97,85.67) v1(53.97,84.66) v1(53.97,83.64) v1(53.97,82.63) v1(53.97,81.61) v1(54.66,78.67) v1(54.66,77.65) v1(54.66,76.64) v1(54.66,75.62) v1(54.99,85.67) v1(54.99,84.66) v1(54.99,83.64) v1(54.99,82.63) v1(54.99,81.61) v1(55.68,78.67) v1(55.68,77.65) v1(55.68,76.64) v1(55.68,75.62) v1(56.01,85.67) v1(56.01,84.66) v1(56.01,83.64) v1(56.01,82.63) v1(56.01,81.61) v1(56.69,78.67) v1(56.69,77.65) v1(56.69,76.64) v1(56.69,75.62) v1(57.02,85.67) v1(57.02,84.66) v1(57.02,83.64) v1(57.02,82.63) v1(57.02,81.61) v1(57.71,78.67) v1(57.71,77.65) v1(57.71,76.64) v1(58.04,85.67) v1(58.04,84.66) v1(58.04,83.64) v1(58.04,82.63) v1(58.04,81.61) v1(58.72,78.67) v1(59.06,85.67) v1(59.06,84.66) v1(59.06,83.64) v1(59.06,82.63) v1(59.06,81.61) v1(59.74,78.67) v1(60.07,85.67) v1(60.07,84.66) v1(60.07,83.64) v1(60.07,82.63) v1(60.07,81.61) v1(61.09,85.67) v1(61.09,84.66) v1(61.09,83.64) v1(61.09,82.63) v1(61.09,81.61)
PHASE_W: length 32.8
  Top Layer w0.635: R40.6 76.58,63.25 75.44,64.39 75.44,68.58 74.55,69.47 C28.2 71.43,70.63 v1(71.43,72.57) ; R60.2 91.84,74.91 89.1,77.65 v1(86.66,77.65) ; v1(69.85,66.04) 68.22,66.04 C33.1
  Bottom Layer w0.635: v1(69.85,66.04) 71.43,67.61 v1(71.43,72.57)
  vias: v1(69.39,76.64) v1(69.39,75.62) v1(69.39,74.6) v1(70.41,76.64) v1(70.41,75.62) v1(70.41,74.6) v1(71.43,76.64) v1(71.43,75.62) v1(71.43,74.6) v1(72.44,76.64) v1(72.44,75.62) v1(72.44,74.6) v1(73.46,76.64) v1(73.46,75.62) v1(73.46,74.6) v1(74.47,76.64) v1(74.47,75.62) v1(74.47,74.6) v1(75.49,76.64) v1(75.49,75.62) v1(76.5,76.64) v1(76.5,75.62) v1(77.52,76.64) v1(77.52,75.62) v1(78.54,77.65) v1(78.54,76.64) v1(78.54,75.62) v1(79.55,78.67) v1(79.55,77.65) v1(79.55,76.64) v1(79.55,75.62) v1(80.57,78.67) v1(80.57,77.65) v1(80.57,76.64) v1(80.57,75.62) v1(80.86,85.67) v1(80.86,84.66) v1(80.86,83.64) v1(80.86,82.63) v1(80.86,81.61) v1(81.59,78.67) v1(81.59,77.65) v1(81.59,76.64) v1(81.59,75.62) v1(81.88,85.67) v1(81.88,84.66) v1(81.88,83.64) v1(81.88,82.63) v1(81.88,81.61) v1(82.6,78.67) v1(82.6,77.65) v1(82.6,76.64) v1(82.6,75.62) v1(82.9,85.67) v1(82.9,84.66) v1(82.9,83.64) v1(82.9,82.63) v1(82.9,81.61) v1(83.62,78.67) v1(83.62,77.65) v1(83.62,76.64) v1(83.62,75.62) v1(83.91,85.67) v1(83.91,84.66) v1(83.91,83.64) v1(83.91,82.63) v1(83.91,81.61) v1(84.63,78.67) v1(84.63,77.65) v1(84.63,76.64) v1(84.63,75.62) v1(84.93,85.67) v1(84.93,84.66) v1(84.93,83.64) v1(84.93,82.63) v1(84.93,81.61) v1(85.65,78.67) v1(85.65,77.65) v1(85.65,76.64) v1(85.94,85.67) v1(85.94,84.66) v1(85.94,83.64) v1(85.94,82.63) v1(85.94,81.61) v1(86.66,78.67) v1(86.96,85.67) v1(86.96,84.66) v1(86.96,83.64) v1(86.96,82.63) v1(86.96,81.61) v1(87.68,78.67) v1(87.98,85.67) v1(87.98,84.66) v1(87.98,83.64) v1(87.98,82.63) v1(87.98,81.61) v1(88.99,85.67) v1(88.99,84.66) v1(88.99,83.64) v1(88.99,82.63) v1(88.99,81.61)
RESET: length 50.9
  Top Layer w0.254: C58.1 45.05,4.67 45.34,4.95 SW1.2 45.34,7.37 v1(45.72,7.75) ; C58.1 39.86,4.67 39.74,4.68 ; C58.1 40.48,4.68 39.74,4.68 ; 39.74,4.68 R61.2 ; U18.7 66.43,26.15 65.91,26.67 v1(65.53,26.67)
  Bottom Layer w0.254: v1(45.72,7.75) 46.86,7.75 47.37,8.25 47.37,12.19 49.53,14.35 63.63,14.35 65.15,15.88 65.15,26.29 v1(65.53,26.67)
RXD: length 45.5
  Top Layer w0.254: 46.29,22.48 46.21,22.4 v1(44.32,22.4) ; v1(71.12,33.78) 71.68,33.23 U18.61
  Inner2 w0.254: v1(44.32,22.4) 43.26,22.4 42.67,22.99 42.67,28.07 43.31,28.7 51.44,28.7 52.2,29.46 52.2,32.89 53.97,34.67 70.23,34.67 71.12,33.78 v1(71.12,33.78)
TXD: length 32.6
  Top Layer w0.254: U18.62 71.18,32.58 69.98,33.78 v1(69.85,33.78) ; v1(46.74,27.94) 46.38,27.58 46.38,26.64 46.29,26.56 U29.1
  Inner2 w0.254: v1(69.85,33.78) 54.48,33.78 53.09,32.39 53.09,29.08 51.94,27.94 v1(46.74,27.94)
U_HIN: length 142.5
  Top Layer w0.254: v1(19.3,51.69) R20.2 ; R73.1 83.31,42.52 v1(83.04,42.8) 83.57,42.8 84.07,43.31 84.07,45.21 84.71,45.85 93.73,45.85 96.77,42.8 96.77,8.89 94.74,6.86 88.65,6.86 88.26,6.48 84.84,6.48 83.44,5.08 H2.8
  Inner1 w0.254: v1(19.3,51.69) 19.3,51.05 22.22,48.13 43.31,48.13 47.37,44.07 81.77,44.07 v1(83.04,42.8)
U_HO: length 3.6
  Top Layer w0.635: R41.1 19.3,63 R20.7
U_LIN: length 142.2
  Top Layer w0.254: R76.1 91.69,42.63 v1(90.89,43.43) 93.85,43.43 95.25,42.04 95.25,9.65 93.98,8.38 87.88,8.38 87.5,8 78.61,8 75.82,5.21 H2.5 ; v1(20.57,51.69) R20.3
  Inner1 w0.254: v1(90.89,43.43) 83.95,43.43 82.42,44.96 48.01,44.96 43.94,49.02 22.61,49.02 20.57,51.05 v1(20.57,51.69)
U_LO: length 3.1
  Top Layer w0.635: R42.1 R20.5
U_VD: length 59.4
  Top Layer w0.254: R79.1 69.34,42.42 68.58,43.18 46.86,43.18 43.69,46.36 39.62,46.36 36.96,49.02 36.96,63.25 37.59,63.88 v1(37.59,67.44) 37.35,67.67 R57.2
  Top Layer w0.635: R59.1 35.94,67.85 35.96,67.84
UH: length 33.1
  Top Layer w0.254: R73.2 83.44,37.51 83.44,36.45 83.69,36.19 85.6,36.19 86.11,35.69 88.26,35.69 88.9,35.05 91.57,35.05 93.22,33.4 93.22,26.67 92.2,25.65 79.61,25.65 U18.41
UL: length 31
  Top Layer w0.254: U18.34 92.76,22.15 94.74,24.13 94.74,34.16 92.33,36.58 91.95,36.58 91.69,36.83 R76.2
UV: length 48.8
  Top Layer w0.254: R79.2 69.34,36.7 69.09,36.45 59.44,36.45 57.15,34.16 57.15,32.21 ; v1(62.48,19.94) 64.13,18.29 65.53,18.29 66.17,18.92 66.17,21.84 66.97,22.65 U18.14
  Inner2 w0.254: v1(62.48,19.94) 62.37,20.05 55.13,20.05 53.97,21.21 53.97,30.86 54.48,31.37 56.77,31.37 57.15,31.75 57.15,32.21
  vias: v1(57.15,32.26)
V_HIN: length 115.4
  Top Layer w0.254: 85.98,2.92 85.98,5.21 86.74,5.97 88.52,5.97 88.9,6.35 95,6.35 97.28,8.64 97.28,43.05 93.73,46.61 84.07,46.61 83.31,45.85 79.99,45.85 v1(79.94,45.8) 80.52,45.22 R74.1 ; v1(47.5,51.69) 47.5,55.55
  Inner1 w0.254: v1(47.5,51.69) 47.5,47.12 48.77,45.85 79.89,45.85 v1(79.94,45.8)
V_HO: length 3.8
  Top Layer w0.635: R39.7 47.5,63 R44.1
V_LIN: length 115.8
  Top Layer w0.254: v1(48.77,51.69) 48.77,55.55 ; R77.1 88.9,43.57 v1(88.02,44.45) 93.6,44.45 95.76,42.29 95.76,9.4 94.23,7.87 88.14,7.87 87.76,7.49 80.65,7.49 78.36,5.21 H2.6
  Inner1 w0.254: v1(88.02,44.45) 84.46,44.45 83.06,45.85 81.28,45.85 80.39,46.74 49.5,46.74 48.77,47.47 v1(48.77,51.69)
V_LO: length 3.2
  Top Layer w0.635: R43.1 R39.5
V_VD: length 37.4
  Top Layer w0.254: R80.1 72.14,46.61 71.12,47.62 65.82,47.62 64.64,48.8 64.64,63.41 65.53,64.3 v1(65.53,67.44) 65.29,67.67 R56.2
  Top Layer w0.635: R32.1 R56.2
VH: length 34.5
  Top Layer w0.254: R74.2 80.39,37.51 80.39,36.58 80.78,36.19 82.94,36.19 83.44,35.69 85.34,35.69 85.85,35.18 88.01,35.18 88.65,34.54 91.31,34.54 92.71,33.15 92.71,26.92 91.94,26.15 U18.42
VL: length 31.9
  Top Layer w0.254: U18.35 92.5,22.65 94.23,24.38 94.23,33.91 92.07,36.07 89.41,36.07 88.9,36.58 88.9,37.14
VSUPPLY: length 28.8
  Top Layer w0.635: U21.2 4.6,20.99 3.94,20.32 3.94,16.51 5.3,15.14 C60.2
  Top Layer w1.27: U12.1 10.16,2.67 6.99,5.83 C59.2 C60.2
  vias: v1(1.55,45.9) v1(1.55,44.89) v1(1.55,43.87) v1(1.55,42.86) v1(1.55,41.84) v1(1.55,40.82) v1(1.55,39.81) v1(1.55,38.79) v1(1.55,37.78) v1(1.55,36.76) v1(1.55,35.74) v1(1.55,34.73) v1(1.55,33.71) v1(1.55,32.69) v1(1.55,31.68) v1(1.55,30.66) v1(1.55,29.65) v1(1.55,28.63) v1(1.55,27.62) v1(1.55,26.6) v1(1.55,25.58) v1(1.55,24.57) v1(1.55,23.55) v1(1.55,22.53) v1(1.55,21.52) v1(1.55,20.5) v1(1.55,19.49) v1(1.55,18.47) v1(1.55,17.46) v1(1.55,16.44) v1(1.55,15.42) v1(1.55,14.41) v1(1.55,13.39) v1(1.55,12.38) v1(1.55,11.36) v1(1.55,10.34) v1(1.55,9.33) v1(1.78,85.98) v1(1.78,84.96) v1(1.78,83.95) v1(1.78,82.93) v1(1.78,81.92) v1(1.78,80.9) v1(1.78,79.88) v1(1.78,78.87) v1(1.78,77.85) v1(1.78,76.83) v1(1.78,75.82) v1(1.78,74.8) v1(1.78,73.79) v1(1.78,72.77) v1(1.78,71.75) v1(1.78,70.74) v1(1.78,69.72) v1(1.78,68.71) v1(1.78,67.69) v1(1.78,66.67) v1(1.78,65.66) v1(1.78,64.64) v1(1.78,63.63) v1(1.78,62.61) v1(1.78,61.59) v1(1.78,60.58) v1(1.78,59.56) v1(1.78,58.55) v1(1.78,57.53) v1(1.78,56.52) v1(1.78,55.5) v1(1.78,54.48) v1(1.78,53.47) v1(1.78,52.45) v1(1.78,51.44) v1(1.78,50.42) v1(1.78,49.4) v1(1.78,48.39) v1(1.78,47.37) v1(2.57,45.9) v1(2.57,44.89) v1(2.57,43.87) v1(2.57,42.86) v1(2.57,41.84) v1(2.57,40.82) v1(2.57,39.81) v1(2.57,38.79) v1(2.57,37.78) v1(2.57,36.76) v1(2.57,35.74) v1(2.57,34.73) v1(2.57,33.71) v1(2.57,32.69) v1(2.57,31.68) v1(2.57,30.66) v1(2.57,29.65) v1(2.57,28.63) v1(2.57,27.62) v1(2.57,26.6) v1(2.57,25.58) v1(2.57,24.57) v1(2.57,23.55) v1(2.57,22.53) v1(2.57,21.52) v1(2.57,20.5) v1(2.57,19.49) v1(2.57,18.47) v1(2.57,17.46) v1(2.57,16.44) v1(2.57,15.42) v1(2.57,14.41) v1(2.57,13.39) v1(2.57,12.38) v1(2.57,11.36) v1(2.57,10.34) v1(2.57,9.33) v1(2.57,8.31) v1(2.79,87) v1(2.79,85.98) v1(2.79,84.96) v1(2.79,83.95) v1(2.79,82.93) v1(2.79,81.92) v1(2.79,80.9) v1(2.79,79.88) v1(2.79,78.87) v1(2.79,77.85) v1(2.79,76.83) v1(2.79,75.82) v1(2.79,74.8) v1(2.79,73.79) v1(2.79,72.77) v1(2.79,71.75) v1(2.79,70.74) v1(2.79,69.72) v1(2.79,68.71) v1(2.79,67.69) v1(2.79,66.67) v1(2.79,65.66) v1(2.79,64.64) v1(2.79,63.63) v1(2.79,62.61) v1(2.79,61.59) v1(2.79,60.58) v1(2.79,59.56) v1(2.79,58.55) v1(2.79,57.53) v1(2.79,56.52) v1(2.79,55.5) v1(2.79,54.48) v1(2.79,53.47) v1(2.79,52.45) v1(2.79,51.44) v1(2.79,50.42) v1(2.79,49.4) v1(2.79,48.39) v1(2.79,47.37) v1(3.58,45.9) v1(3.58,44.89) v1(3.58,43.87) v1(3.58,42.86) v1(3.58,41.84) v1(3.58,40.82) v1(3.58,39.81) v1(3.58,38.79) v1(3.58,37.78) v1(3.58,36.76) v1(3.58,35.74) v1(3.58,14.41) v1(3.58,13.39) v1(3.58,12.38) v1(3.58,11.36) v1(3.58,10.34) v1(3.58,9.33) v1(3.58,8.31) v1(3.58,7.29) v1(3.81,88.01) v1(3.81,87) v1(3.81,85.98) v1(3.81,84.96) v1(3.81,83.95) v1(3.81,82.93) v1(3.81,81.92) v1(3.81,80.9) v1(3.81,79.88) v1(3.81,78.87) v1(3.81,77.85) v1(3.81,76.83) v1(3.81,75.82) v1(3.81,74.8) v1(3.81,73.79) v1(3.81,72.77) v1(3.81,71.75) v1(3.81,70.74) v1(3.81,69.72) v1(3.81,68.71) v1(3.81,67.69) v1(3.81,66.67) v1(3.81,65.66) v1(3.81,64.64) v1(3.81,63.63) v1(3.81,62.61) v1(3.81,61.59) v1(3.81,60.58) v1(3.81,59.56) v1(3.81,58.55) v1(3.81,57.53) v1(3.81,56.52) v1(3.81,55.5) v1(3.81,54.48) v1(3.81,53.47) v1(3.81,52.45) v1(3.81,51.44) v1(3.81,50.42) v1(3.81,49.4) v1(3.81,48.39) v1(3.81,47.37) v1(4.6,45.9) v1(4.6,44.89) v1(4.6,43.87) v1(4.6,42.86) v1(4.6,41.84) v1(4.6,40.82) v1(4.6,39.81) v1(4.6,38.79) v1(4.6,37.78) v1(4.6,36.76) v1(4.6,13.39) v1(4.6,12.38) v1(4.6,11.36) v1(4.6,10.34) v1(4.6,9.33) v1(4.6,8.31) v1(4.6,7.29) v1(4.6,6.28) v1(4.83,89.03) v1(4.83,88.01) v1(4.83,87) v1(4.83,85.98) v1(4.83,84.96) v1(4.83,83.95) v1(4.83,82.93) v1(4.83,81.92) v1(4.83,80.9) v1(4.83,79.88) v1(4.83,78.87) v1(4.83,77.85) v1(4.83,76.83) v1(4.83,75.82) v1(4.83,74.8) v1(4.83,73.79) v1(4.83,72.77) v1(4.83,71.75) v1(4.83,70.74) v1(4.83,69.72) v1(4.83,68.71) v1(4.83,67.69) v1(4.83,66.67) v1(4.83,65.66) v1(4.83,64.64) v1(4.83,63.63) v1(4.83,62.61) v1(4.83,61.59) v1(4.83,60.58) v1(4.83,59.56) v1(4.83,58.55) v1(4.83,57.53) v1(4.83,56.52) v1(4.83,55.5) v1(4.83,54.48) v1(4.83,53.47) v1(4.83,52.45) v1(4.83,51.44) v1(4.83,50.42) v1(4.83,49.4) v1(4.83,48.39) v1(4.83,47.37) v1(5.62,9.33) v1(5.62,8.31) v1(5.62,7.29) v1(5.62,6.28) v1(5.62,5.26) v1(5.84,90.04) v1(5.84,89.03) v1(5.84,88.01) v1(5.84,87) v1(5.84,85.98) v1(5.84,84.96) v1(5.84,83.95) v1(5.84,82.93) v1(5.84,81.92) v1(5.84,80.9) v1(5.84,79.88) v1(6.63,8.31) v1(6.63,7.29) v1(6.63,6.28) v1(6.63,5.26) v1(6.63,4.25) v1(6.86,91.06) v1(6.86,90.04) v1(6.86,89.03) v1(6.86,88.01) v1(6.86,87) v1(6.86,85.98) v1(6.86,84.96) v1(6.86,83.95) v1(6.86,82.93) v1(6.86,81.92) v1(6.86,80.9) v1(7.65,7.29) v1(7.65,6.28) v1(7.65,5.26) v1(7.65,4.25) v1(7.65,3.23) v1(7.87,92.08) v1(7.87,91.06) v1(7.87,90.04) v1(7.87,89.03) v1(7.87,88.01) v1(7.87,87) v1(7.87,85.98) v1(7.87,84.96) v1(7.87,83.95) v1(7.87,82.93) v1(7.87,81.92) v1(7.87,80.9) v1(8.66,6.28) v1(8.66,5.26) v1(8.66,4.25) v1(8.66,3.23) v1(8.66,2.22) v1(8.89,93.09) v1(8.89,92.08) v1(8.89,91.06) v1(8.89,90.04) v1(8.89,89.03) v1(8.89,88.01) v1(8.89,87) v1(8.89,85.98) v1(8.89,84.96) v1(8.89,83.95) v1(8.89,82.93) v1(8.89,81.92) v1(8.89,80.9) v1(9.68,5.26) v1(9.68,4.25) v1(9.68,3.23) v1(9.68,2.22) v1(9.91,93.09) v1(10.7,4.25) v1(10.7,3.23) v1(10.7,2.22) v1(11.05,85.67) v1(11.05,84.66) v1(11.05,83.64) v1(11.05,82.63) v1(11.05,81.61) v1(11.1,92.02) v1(11.1,91.01) v1(11.1,89.99) v1(11.1,88.98) v1(11.71,3.23) v1(11.71,2.22) v1(12.12,93.04) v1(12.12,92.02) v1(12.12,91.01) v1(12.12,89.99) v1(12.12,88.98) v1(12.06,85.67) v1(12.06,84.66) v1(12.06,83.64) v1(12.06,82.63) v1(12.06,81.61) v1(12.73,3.23) v1(12.73,2.22) v1(13.13,93.04) v1(13.13,92.02) v1(13.13,91.01) v1(13.13,89.99) v1(13.13,88.98) v1(13.08,85.67) v1(13.08,84.66) v1(13.08,83.64) v1(13.08,82.63) v1(13.08,81.61) v1(14.15,93.04) v1(14.15,92.02) v1(14.15,91.01) v1(14.15,89.99) v1(14.15,88.98) v1(14.1,85.67) v1(14.1,84.66) v1(14.1,83.64) v1(14.1,82.63) v1(14.1,81.61) v1(15.11,85.67) v1(15.11,84.66) v1(15.11,83.64) v1(15.11,82.63) v1(15.11,81.61) v1(15.16,93.04) v1(15.16,92.02) v1(15.16,91.01) v1(15.16,89.99) v1(15.16,88.98) v1(15.16,87.96) v1(16.13,85.67) v1(16.13,84.66) v1(16.13,83.64) v1(16.13,82.63) v1(16.13,81.61) v1(16.18,93.04) v1(16.18,92.02) v1(16.18,91.01) v1(16.18,89.99) v1(16.18,88.98) v1(17.14,85.67) v1(17.14,84.66) v1(17.14,83.64) v1(17.14,82.63) v1(17.14,81.61) v1(17.2,93.04) v1(17.2,92.02) v1(17.2,91.01) v1(17.2,89.99) v1(17.2,88.98) v1(18.21,93.04) v1(18.21,92.02) v1(18.21,91.01) v1(18.21,89.99) v1(18.21,88.98) v1(18.16,85.67) v1(18.16,84.66) v1(18.16,83.64) v1(18.16,82.63) v1(18.16,81.61) v1(19.23,93.04) v1(19.23,92.02) v1(19.23,91.01) v1(19.23,89.99) v1(19.23,88.98) v1(19.18,85.67) v1(19.18,84.66) v1(19.18,83.64) v1(19.18,82.63) v1(19.18,81.61) v1(20.24,93.04) v1(20.24,92.02) v1(20.24,91.01) v1(20.24,89.99) v1(21.26,93.04) v1(21.26,92.02) v1(21.26,91.01) v1(21.26,89.99) v1(22.28,93.04) v1(22.28,92.02) v1(22.28,91.01) v1(22.28,89.99) v1(37.52,93.04) v1(37.52,92.02) v1(37.52,91.01) v1(37.52,89.99) v1(38.53,93.04) v1(38.53,92.02) v1(38.53,91.01) v1(38.53,89.99) v1(38.53,88.98) v1(38.99,85.67) v1(38.99,84.66) v1(38.99,83.64) v1(38.99,82.63) v1(38.99,81.61) v1(39.55,93.04) v1(39.55,92.02) v1(39.55,91.01) v1(39.55,89.99) v1(39.55,88.98) v1(40,85.67) v1(40,84.66) v1(40,83.64) v1(40,82.63) v1(40,81.61) v1(40.56,93.04) v1(40.56,92.02) v1(40.56,91.01) v1(40.56,89.99) v1(40.56,88.98) v1(41.02,85.67) v1(41.02,84.66) v1(41.02,83.64) v1(41.02,82.63) v1(41.02,81.61) v1(41.58,93.04) v1(41.58,92.02) v1(41.58,91.01) v1(41.58,89.99) v1(41.58,88.98) v1(42.04,85.67) v1(42.04,84.66) v1(42.04,83.64) v1(42.04,82.63) v1(42.04,81.61) v1(42.6,93.04) v1(42.6,92.02) v1(42.6,91.01) v1(42.6,89.99) v1(42.6,88.98) v1(43.05,85.67) v1(43.05,84.66) v1(43.05,83.64) v1(43.05,82.63) v1(43.05,81.61) v1(43.61,93.04) v1(43.61,92.02) v1(43.61,91.01) v1(43.61,89.99) v1(43.61,88.98) v1(44.07,85.67) v1(44.07,84.66) v1(44.07,83.64) v1(44.07,82.63) v1(44.07,81.61) v1(44.63,93.04) v1(44.63,92.02) v1(44.63,91.01) v1(44.63,89.99) v1(44.63,88.98) v1(45.09,85.67) v1(45.09,84.66) v1(45.09,83.64) v1(45.09,82.63) v1(45.09,81.61) v1(45.64,93.04) v1(45.64,92.02) v1(45.64,91.01) v1(45.64,89.99) v1(45.64,88.98) v1(46.1,85.67) v1(46.1,84.66) v1(46.1,83.64) v1(46.1,82.63) v1(46.1,81.61) v1(46.66,93.04) v1(46.66,92.02) v1(46.66,91.01) v1(46.66,89.99) v1(46.66,88.98) v1(47.12,85.67) v1(47.12,84.66) v1(47.12,83.64) v1(47.12,82.63) v1(47.12,81.61) v1(47.68,93.04) v1(47.68,92.02) v1(47.68,91.01) v1(47.68,89.99) v1(47.68,88.98) v1(48.69,93.04) v1(48.69,92.02) v1(48.69,91.01) v1(48.69,89.99) v1(63.93,93.04) v1(63.93,92.02) v1(63.93,91.01) v1(63.93,89.99) v1(64.95,93.04) v1(64.95,92.02) v1(64.95,91.01) v1(64.95,89.99) v1(65.96,93.04) v1(65.96,92.02) v1(65.96,91.01) v1(65.96,89.99) v1(66.89,85.67) v1(66.89,84.66) v1(66.89,83.64) v1(66.89,82.63) v1(66.89,81.61) v1(66.98,93.04) v1(66.98,92.02) v1(66.98,91.01) v1(66.98,89.99) v1(66.98,88.98) v1(67.91,85.67) v1(67.91,84.66) v1(67.91,83.64) v1(67.91,82.63) v1(67.91,81.61) v1(68,93.04) v1(68,92.02) v1(68,91.01) v1(68,89.99) v1(68,88.98) v1(68.93,85.67) v1(68.93,84.66) v1(68.93,83.64) v1(68.93,82.63) v1(68.93,81.61) v1(69.01,93.04) v1(69.01,92.02) v1(69.01,91.01) v1(69.01,89.99) v1(69.01,88.98) v1(69.94,85.67) v1(69.94,84.66) v1(69.94,83.64) v1(69.94,82.63) v1(69.94,81.61) v1(70.03,93.04) v1(70.03,92.02) v1(70.03,91.01) v1(70.03,89.99) v1(70.03,88.98) v1(71.04,93.04) v1(71.04,92.02) v1(71.04,91.01) v1(71.04,89.99) v1(71.04,88.98) v1(71.04,87.96) v1(70.96,85.67) v1(70.96,84.66) v1(70.96,83.64) v1(70.96,82.63) v1(70.96,81.61) v1(71.97,85.67) v1(71.97,84.66) v1(71.97,83.64) v1(71.97,82.63) v1(71.97,81.61) v1(72.06,93.04) v1(72.06,92.02) v1(72.06,91.01) v1(72.06,89.99) v1(72.06,88.98) v1(72.99,85.67) v1(72.99,84.66) v1(72.99,83.64) v1(72.99,82.63) v1(72.99,81.61) v1(73.08,93.04) v1(73.08,92.02) v1(73.08,91.01) v1(73.08,89.99) v1(73.08,88.98) v1(74.01,85.67) v1(74.01,84.66) v1(74.01,83.64) v1(74.01,82.63) v1(74.01,81.61) v1(74.09,93.04) v1(74.09,92.02) v1(74.09,91.01) v1(74.09,89.99) v1(74.09,88.98) v1(75.02,85.67) v1(75.02,84.66) v1(75.02,83.64) v1(75.02,82.63) v1(75.02,81.61) v1(75.11,93.04) v1(75.11,92.02) v1(75.11,91.01) v1(75.11,89.99) v1(75.11,88.98)
VV: length 50.4
  Top Layer w0.254: v1(58.29,32.26) 58.29,34.04 60.07,35.81 71.63,35.81 72.14,36.32 R80.2 ; v1(59.29,20.66) 59.86,20.66 62.87,17.65 66.04,17.65 66.8,18.41 66.8,21.72 67.24,22.15 U18.15
  Inner2 w0.254: v1(59.29,20.66) 55.67,20.66 54.74,21.59 54.74,30.1 55.25,30.61 57.78,30.61 58.29,31.12 v1(58.29,32.26)
W_HIN: length 87
  Top Layer w0.254: H2.10 88.52,5.21 89.15,5.84 95.25,5.84 97.79,8.38 97.79,43.31 93.6,47.5 v1(76.45,47.5) 77.72,46.23 R75.1 ; v1(75.31,52.83) R40.2
  Inner1 w0.254: v1(76.45,47.5) 76.39,47.5 75.31,48.58 v1(75.31,52.83)
W_HO: length 3.6
  Top Layer w0.635: 74.04,64.27 74.04,64.01 75.31,62.74 R40.7
W_LIN: length 86.9
  Top Layer w0.254: R78.1 86.11,44.22 v1(85.11,45.21) 93.6,45.21 96.27,42.55 96.27,9.14 94.49,7.37 88.39,7.37 88.01,6.99 82.68,6.99 80.9,5.21 H2.7 ; v1(76.58,52.83) R40.3
  Inner1 w0.254: v1(85.11,45.21) 83.84,46.48 81.66,46.48 80.65,47.5 77.85,47.5 76.58,48.77 v1(76.58,52.83)
W_LO: length 3.1
  Top Layer w0.635: R46.1 R40.5
W_VD: length 45.3
  Top Layer w0.254: R58.2 93.15,67.67 v1(93.46,67.37) 93.46,64.12 91.95,62.61 91.95,52.7 87.5,48.26 75.75,48.26 74.93,47.44 R81.1
  Top Layer w0.635: 91.82,67.82 91.84,67.84 R60.1
WH: length 34.9
  Top Layer w0.254: 77.72,37.13 77.72,36.58 77.98,36.32 79.88,36.32 80.52,35.69 82.68,35.69 83.19,35.18 85.09,35.18 85.6,34.67 87.76,34.67 88.39,34.04 91.06,34.04 92.2,32.89 92.2,27.43 91.42,26.65 U18.43
WL: length 33.7
  Top Layer w0.254: R78.2 86.11,36.45 86.36,36.19 88.52,36.19 89.15,35.56 91.82,35.56 93.73,33.66 93.73,24.64 92.24,23.15 U18.36
WV: length 51
  Top Layer w0.254: 59.44,32.13 59.44,33.91 60.71,35.18 73.79,35.18 74.93,36.32 R81.2 ; v1(56.26,24.46) 57.66,23.06 57.66,21.08 61.72,17.02 66.68,17.02 68.23,18.57 U18.16
  Inner2 w0.254: v1(56.26,24.46) 55.37,25.35 55.37,29.34 55.88,29.84 58.8,29.84 59.44,30.48 59.44,32.13
  vias: v1(59.44,32.26)
$1N18971: length 8.5
  Top Layer w0.635: R20.8 15.09,61.16 D4.2 13.36,60.81 12.19,61.98 C31.2
$1N19331: length 11.9
  Top Layer w0.635: R41.2 16.26,65.78 13.52,68.52 C30.1 11.81,69.47 11.3,69.98 11.3,72.83
$1N19521: length 9.5
  Top Layer w0.635: 25.26,72.83 23.55,72.83 22.54,71.81 C25.1 22.54,67.62 21.84,66.93 R42.2
$1N20357: length 12.1
  Top Layer w0.635: 39.24,72.83 39.24,70.1 39.88,69.47 C29.1 41.46,68.52 44.2,65.78 R44.2
$1N20372: length 9.2
  Top Layer w0.635: R43.2 50.04,67.18 50.48,67.62 C26.1 50.48,71.56 51.63,72.71 53.1,72.71 53.21,72.83
$1N20703: length 11.7
  Top Layer w0.635: R45.2 72.19,65.78 69.4,68.57 C28.1 67.94,69.47 67.15,70.27 67.15,72.83
$1N20718: length 9.2
  Top Layer w0.635: 81.12,72.83 79.69,72.83 78.42,71.56 C27.1 78.42,67.62 77.85,67.06 R46.2
$1N21329: length 8.5
  Top Layer w0.635: C32.2 40.39,61.85 41.56,60.68 D5.2 43.28,61.03 R39.8
$1N21568: length 8.5
  Top Layer w0.635: C33.2 68.2,61.98 69.37,60.81 D6.2 71.09,61.16 R40.8
$2N2212: length 19.8
  Top Layer w0.254: U18.47 81.48,28.65 82.42,29.59 v1(84.07,29.59) ; v1(85.44,17.63) C51.2
  Bottom Layer w0.254: v1(84.07,29.59) 84.46,29.59 85.44,28.6 v1(85.44,17.63)
$2N2213: length 7.9
  Top Layer w0.254: U18.31 77.18,18.07 79.9,15.35 C52.2
$2N3961: length 7.1
  Top Layer w0.254: X3.1 64.71,30.41 65.53,29.59 65.53,28.57 66.96,27.15 U18.5
$2N3971: length 5.7
  Top Layer w0.254: U18.6 66.69,26.65 65.34,28.01 X3.3
$2N5800: length 11.1
  Top Layer w0.254: 51.5,25.02 54.1,25.02 56.25,22.88 R84.2 56.5,21.59 56.5,17.53
$2N5978: length 8.6
  Top Layer w0.254: U29.6 53.09,23.75 54.25,22.59 R84.1 54.48,21.61 54.48,18.01 54,17.53
$3N1194: length 13.1
  Top Layer w0.635: C61.1 21.02,17.09 20.57,16.64 16.38,16.64 16,17.02 16,17.91 12.92,20.99 U21.7
$3N1200: length 22.9
  Top Layer w0.762: L2.1 13.3,26.2 16.76,22.73 D7.1 17.84,22.05 C61.2 17.53,18.16 13.43,22.25 U21.8
$3N1280: length 4.3
  Top Layer w0.635: 12.75,15.11 12.75,17.99 12.29,18.44 U21.5
$3N1335: length 11.1
  Top Layer w0.635: U21.6 12.54,19.72 14.35,17.91 14.35,12.32 15.04,11.63 15.98,11.63 C62.1
$3N1802: length 6.3
  Top Layer w0.635: R72.2 R64.1 18.43,13.32 18.68,13.07 R63.2
$3N2447: length 4.1
  Top Layer w0.508: R65.2 10.47,45.15 U23.4
$3N2564: length 18.3
  Top Layer w0.254: U23.6 14.34,41.92 14.92,41.34 U24.1 20.89,41.34 21.21,41.02 21.21,39.12 20.32,38.23 18.29,38.23 17.72,37.65 17.72,35.5 18.53,34.69 18.92,34.69
$3N2639: length 12.1
  Top Layer w0.254: 18.92,36.69 19.54,36.69 21.72,38.86 21.72,41.4 19.87,43.25 U23.1
$3N2843: length 2.8
  Top Layer w0.254: R83.1 R82.2
$3N2847: length 23.6
  Top Layer w0.254: U23.3 18.73,45.15 22.22,41.66 22.22,38.61 21.08,37.47 21.08,33.91 20.57,33.4 16.64,33.4 16.25,33.79 R66.2 R82.1
$3N3585: length 13.2
  Top Layer w0.254: v1(27.81,13.08) 26.8,13.08 26.54,12.83 R69.2 ; v1(30.23,20.57) 30.23,20.7 29.71,21.22 U25.4
  Bottom Layer w0.254: v1(30.23,20.57) 30.48,20.32 30.48,14.22 29.34,13.08 v1(27.81,13.08)
$3N3587: length 10.1
  Top Layer w0.254: 27.24,21.09 27.2,21.13 25.71,21.13 25.53,20.96 25.53,17.43 U26.1 28.54,16.05 29.35,15.24
$3N3594: length 7.4
  Top Layer w0.254: 31.35,15.24 31.42,15.31 31.42,16.71 30.99,17.15 27.69,17.15 27.12,17.71 U25.1
$3N3603: length 12.2
  Top Layer w0.254: R70.2 R71.1 31.88,12.32 33.02,13.46 33.02,16.13 30.23,18.92 U25.3
$4N1093: length 8
  Top Layer w0.254: U13.6 27.51,57.3 27.51,56.44 27.81,56.13 28.96,56.13 29.77,55.32 R48.2 R49.2
$4N1104: length 8.1
  Top Layer w0.254: U14.6 55.62,56.27 55.88,56.01 57.4,56.01 57.77,55.64 R51.2 R52.2
$4N1115: length 8.3
  Top Layer w0.254: U15.6 83.43,56.14 83.69,55.88 85.34,55.88 85.71,55.52 R54.2 R55.2

## Copper pours and planes (outline as drawn; the poured copper is in the pictures)
3.3V on Top Layer: 14.22,49.66 42.42,49.66 42.42,13.13 14.22,13.13
3.3V on Bottom Layer: 25.76,14.96 28.05,14.96 28.05,13.82 25.76,13.82
3.3V on Inner2: 14.22,49.66 17.53,49.66 17.53,47.88 14.22,47.88
12V on Top Layer: 4.83,32.89 17.99,32.89 17.99,27.05 4.83,27.05
12V on Bottom Layer: 11.66,54.61 17.99,54.61 17.99,30.61 11.66,30.61
+5V on Bottom Layer: 18.42,40.26 20.7,40.26 20.7,39.12 18.42,39.12
AGND on Top Layer: 87,67.44 92.58,67.44 92.58,63.88 87,63.88
AGND on Top Layer: 59.04,67.45 64.63,67.45 64.63,63.9 59.04,63.9
AGND on Top Layer: 31.1,67.44 36.69,67.44 36.69,63.88 31.1,63.88
AGND on Bottom Layer: 7.32,29.34 23.62,29.34 23.62,9.78 7.32,9.78
AGND on Bottom Layer: 42.42,14.6 43.43,13.59 43.43,9.4 42.42,8.38 25.78,8.38 24.32,9.84 24.32,27.11 21.46,29.97 19.38,29.97 18.69,30.66 18.69,32.28 19.3,32.89 29.46,32.89 30.48,31.88 30.48,21.72 31.12,21.08 31.12,16.76 33.27,14.6
AGND on Bottom Layer: 6.48,67.45 89.53,67.45 89.53,0.63 6.48,0.63
AGND on Bottom Layer: 25.38,36.45 21.53,36.45 20.8,35.72 20.8,33.37 14.13,33.37 13.84,33.66 13.84,45.6 13.96,45.72 18.67,45.72 22.73,41.66 22.73,39.75 23.5,38.99 25.4,38.99 25.78,38.61 25.78,36.85
CUR1 on Top Layer: 24.96,73.72 33.28,73.72 33.28,61.4 24.96,61.4
CUR2 on Top Layer: 52.86,73.72 61.19,73.72 61.19,61.4 52.86,61.4
CUR3 on Top Layer: 80.8,73.72 89.13,73.72 89.13,61.4 80.8,61.4
PHASE_U on Top Layer: 12.13,87.57 34.35,87.57 34.35,71.95 12.13,71.95
PHASE_U on Bottom Layer: 12.13,87.57 34.35,87.57 34.35,71.95 12.13,71.95
PHASE_U on Bottom Layer: 24.51,97.54 46.61,97.54 46.61,80.01 24.51,80.01
PHASE_V on Top Layer: 40.13,87.5 62.36,87.5 62.36,71.88 40.13,71.88
PHASE_V on Bottom Layer: 40.13,87.5 62.36,87.5 62.36,71.88 40.13,71.88
PHASE_V on Bottom Layer: 48.01,97.54 61.72,97.54 61.72,80.14 48.01,80.14
PHASE_W on Top Layer: 68.01,87.57 90.23,87.57 90.23,71.95 68.01,71.95
PHASE_W on Bottom Layer: 68.01,87.57 90.23,87.57 90.23,71.95 68.01,71.95
PHASE_W on Bottom Layer: 53.34,97.5 89.53,97.5 89.53,80.14 53.34,80.14
VSUPPLY on Top Layer: 9.78,93.85 76.33,93.85 76.33,80.14 9.78,80.14
VSUPPLY on Top Layer: 0.66,93.85 16.99,93.85 16.99,0.86 0.66,0.86
VSUPPLY on Top Layer: 20.45,87.5 13.08,87.5 20.45,80.14
VSUPPLY on Bottom Layer: 9.78,93.85 22.73,93.85 22.73,80.14 9.78,80.14
VSUPPLY on Bottom Layer: 36.45,93.85 49.4,93.85 49.4,80.14 36.45,80.14
VSUPPLY on Bottom Layer: 62.87,93.85 76.33,93.85 76.33,80.14 62.87,80.14
VSUPPLY on Inner1: 36.45,93.85 49.4,93.85 49.4,80.14 36.45,80.14
VSUPPLY on Inner1: 62.87,93.85 76.33,93.85 76.33,80.14 62.87,80.14
VSUPPLY on Inner1: 9.78,93.85 22.73,93.85 22.73,80.14 9.78,80.14
VSUPPLY on Inner2: 0.66,93.85 16.99,93.85 16.99,0.86 0.66,0.86
VSUPPLY on Inner2: 9.78,93.85 76.33,93.85 76.33,80.14 9.78,80.14

## Text on the board
Top Silkscreen Layer: Design By CHAIYANAN
